# EAGLE schematic Krakatau Board v1.3 (EAGLE 9.6.0)

## Sheet 1 of 7: Microcontroller STM32F413VHT6
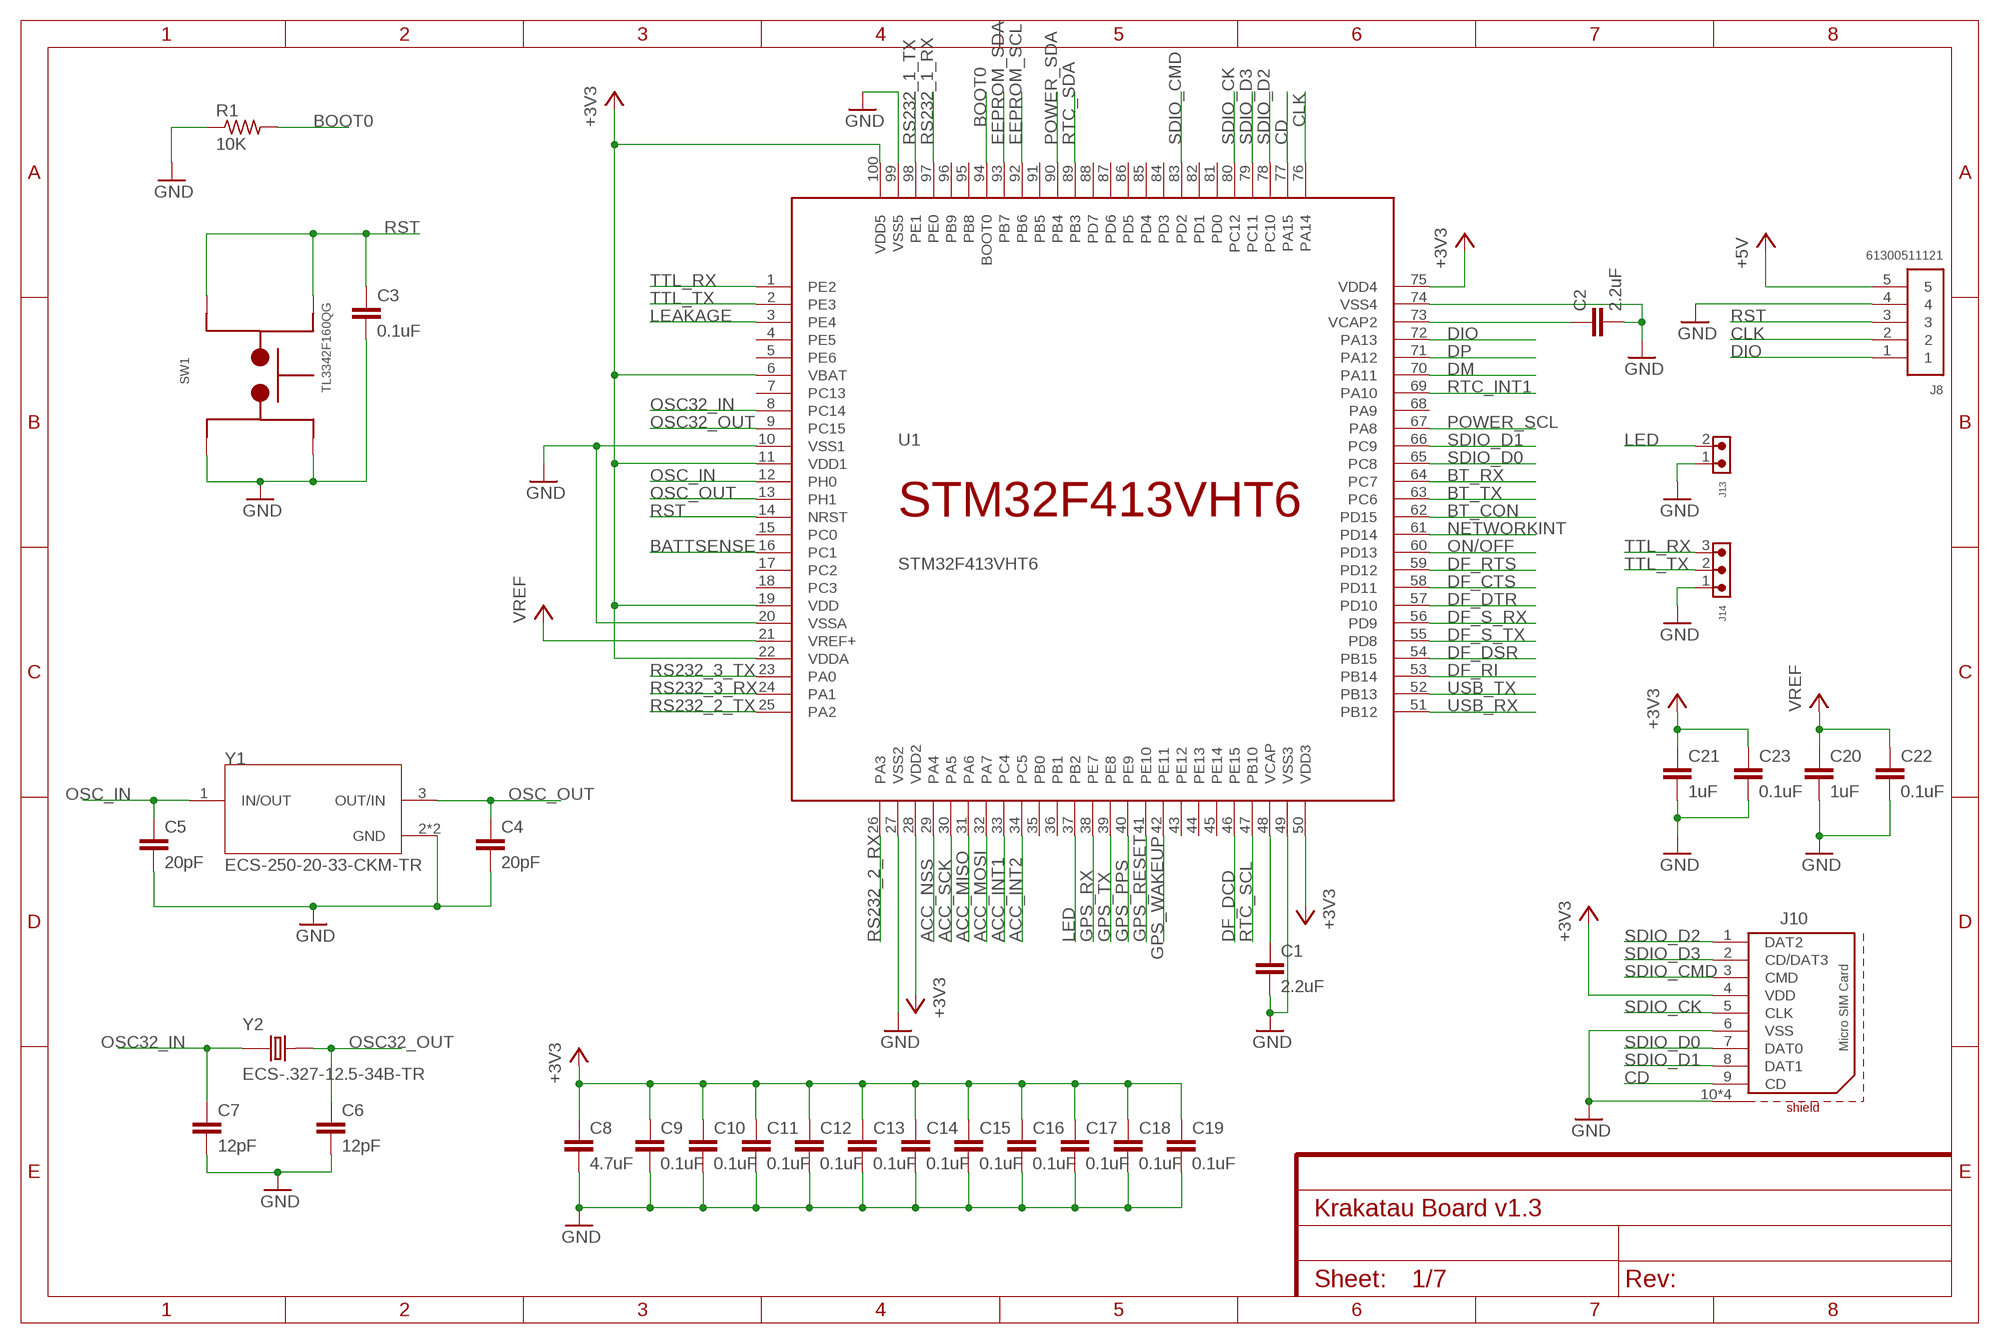
[diagram p0: schematic, sheet 1]

### Parts
C1  2.2uF  C0402-KEMET  [CAPC1005X50N-0402-KEMET]
C2  2.2uF  C0402-KEMET  [CAPC1005X50N-0402-KEMET]
C3  0.1uF  C0402-KEMET  [CAPC1005X50N-0402-KEMET]
C4  20pF  C0402-KEMET  [CAPC1005X50N-0402-KEMET]
C5  20pF  C0402-KEMET  [CAPC1005X50N-0402-KEMET]
C6  12pF  C0402-KEMET  [CAPC1005X50N-0402-KEMET]
C7  12pF  C0402-KEMET  [CAPC1005X50N-0402-KEMET]
C8  4.7uF  C1210-KEMET  [CAPC3225X90N-1210-KEMET]
C9  0.1uF  C0402-KEMET  [CAPC1005X50N-0402-KEMET]
C10  0.1uF  C0402-KEMET  [CAPC1005X50N-0402-KEMET]
C11  0.1uF  C0402-KEMET  [CAPC1005X50N-0402-KEMET]
C12  0.1uF  C0402-KEMET  [CAPC1005X50N-0402-KEMET]
C13  0.1uF  C0402-KEMET  [CAPC1005X50N-0402-KEMET]
C14  0.1uF  C0402-KEMET  [CAPC1005X50N-0402-KEMET]
C15  0.1uF  C0402-KEMET  [CAPC1005X50N-0402-KEMET]
C16  0.1uF  C0402-KEMET  [CAPC1005X50N-0402-KEMET]
C17  0.1uF  C0402-KEMET  [CAPC1005X50N-0402-KEMET]
C18  0.1uF  C0402-KEMET  [CAPC1005X50N-0402-KEMET]
C19  0.1uF  C0402-KEMET  [CAPC1005X50N-0402-KEMET]
C20  1uF  C0603-KEMET  [CAPC1608X80N-0603-KEMET]
C21  1uF  C0603-KEMET  [CAPC1608X80N-0603-KEMET]
C22  0.1uF  C0402-KEMET  [CAPC1005X50N-0402-KEMET]
C23  0.1uF  C0402-KEMET  [CAPC1005X50N-0402-KEMET]
J8  61300511121  [61300511121]
J10  693071020811  [693071020811]
J13  61900211121  [61900211121]
J14  61900311121  [61900311121]
R1  10K  R0402-VISHAYDALE  [RESC1005X35N-0402-VISHAYDALE]
SW1  TL3342F160QG  [SW_TL3342F160QG]
U1  STM32F413VHT6  [QFP50P1590X1590X160-100N]
Y1  ECS-250-20-33-CKM-TR  [XTAL_ECS-250-20-33-CKM-TR]
Y2  ECS-.327-12.5-34B-TR  [XTAL_ECS-.327-12.5-34B-TR]

### Nets
+3V3: C8.1 C9.1 C10.1 C11.1 C12.1 C13.1 C14.1 C15.1 C16.1 C17.1 C18.1 C19.1 C21.1 C23.1 J10.4(VDD) U1.6(VBAT) U1.11(VDD1) U1.19(VDD) U1.22(VDDA) U1.28(VDD2) U1.50(VDD3) U1.75(VDD4) U1.100(VDD5) ; also sheet 2,3,5,6,7
+5V: J8.5 ; also sheet 2,3,4
ACC_INT1: U1.33(PC4) ; also sheet 7
ACC_INT2: U1.34(PC5) ; also sheet 7
ACC_MISO: U1.31(PA6) ; also sheet 7
ACC_MOSI: U1.32(PA7) ; also sheet 7
ACC_NSS: U1.29(PA4) ; also sheet 7
ACC_SCK: U1.30(PA5) ; also sheet 7
BATTSENSE: U1.16(PC1) ; also sheet 3
BOOT0: R1.2 U1.94(BOOT0)
BT_CON: U1.62(PD15) ; also sheet 2
BT_RX: U1.64(PC7) ; also sheet 2
BT_TX: U1.63(PC6) ; also sheet 2
CD: J10.9(CD) U1.77(PA15)
CLK: J8.2 U1.76(PA14)
DF_CTS: U1.58(PD11) ; also sheet 2
DF_DCD: U1.46(PE15) ; also sheet 2
DF_DSR: U1.54(PB15) ; also sheet 2
DF_DTR: U1.57(PD10) ; also sheet 2
DF_RI: U1.53(PB14) ; also sheet 2
DF_RTS: U1.59(PD12) ; also sheet 2
DF_S_RX: U1.56(PD9) ; also sheet 2
DF_S_TX: U1.55(PD8) ; also sheet 2
DIO: J8.1 U1.72(PA13)
DM: U1.70(PA11)
DP: U1.71(PA12)
EEPROM_SCL: U1.92(PB6) ; also sheet 6
EEPROM_SDA: U1.93(PB7) ; also sheet 6
GND: C1.2 C2.2 C3.2 C4.2 C5.2 C6.2 C7.2 C8.2 C9.2 C10.2 C11.2 C12.2 C13.2 C14.2 C15.2 C16.2 C17.2 C18.2 C19.2 C20.2 C21.2 C22.2 C23.2 J8.4 J10.6(VSS) J10.10(SHIELD) J10.11(SHIELD) J10.12(SHIELD) J10.13(SHIELD) J13.1 J14.1 R1.1 SW1.1 SW1.2 U1.10(VSS1) U1.20(VSSA) U1.27(VSS2) U1.49(VSS3) U1.74(VSS4) U1.99(VSS5) Y1.2(GND) Y1.4(GND) ; also sheet 2,3,4,5,6,7
GPS_PPS: U1.40(PE9) ; also sheet 5
GPS_RESET: U1.41(PE10) ; also sheet 5
GPS_RX: U1.38(PE7) ; also sheet 5
GPS_TX: U1.39(PE8) ; also sheet 5
GPS_WAKEUP: U1.42(PE11) ; also sheet 5
LEAKAGE: U1.3(PE4) ; also sheet 7
LED: J13.2 U1.37(PB2)
N$1: C2.1 U1.73(VCAP2)
N$2: C1.1 U1.48(VCAP)
NETWORKINT: U1.61(PD14) ; also sheet 2
ON/OFF: U1.60(PD13) ; also sheet 2
OSC32_IN: C7.1 U1.8(PC14) Y2.1
OSC32_OUT: C6.1 U1.9(PC15) Y2.2
OSC_IN: C5.1 U1.12(PH0) Y1.1(IN/OUT)
OSC_OUT: C4.1 U1.13(PH1) Y1.3(OUT/IN)
POWER_SCL: U1.67(PA8) ; also sheet 7
POWER_SDA: U1.90(PB4) ; also sheet 7
RS232_1_RX: U1.97(PE0) ; also sheet 4
RS232_1_TX: U1.98(PE1) ; also sheet 4
RS232_2_RX: U1.26(PA3) ; also sheet 4
RS232_2_TX: U1.25(PA2) ; also sheet 4
RS232_3_RX: U1.24(PA1) ; also sheet 4
RS232_3_TX: U1.23(PA0) ; also sheet 4
RST: C3.1 J8.3 SW1.3 SW1.4 U1.14(NRST)
RTC_INT1: U1.69(PA10) ; also sheet 6
RTC_SCL: U1.47(PB10) ; also sheet 6
RTC_SDA: U1.89(PB3) ; also sheet 6
SDIO_CK: J10.5(CLK) U1.80(PC12)
SDIO_CMD: J10.3(CMD) U1.83(PD2)
SDIO_D0: J10.7(DAT0) U1.65(PC8)
SDIO_D1: J10.8(DAT1) U1.66(PC9)
SDIO_D2: J10.1(DAT2) U1.78(PC10)
SDIO_D3: J10.2(CD/DAT3) U1.79(PC11)
TTL_RX: J14.3 U1.1(PE2)
TTL_TX: J14.2 U1.2(PE3)
USB_RX: U1.51(PB12) ; also sheet 4
USB_TX: U1.52(PB13) ; also sheet 4
VCC: C20.1 C22.1 U1.21(VREF+) ; supply symbol labelled VREF ; also sheet 3
Unconnected: U1.4(PE5) U1.5(PE6) U1.7(PC13) U1.15(PC0) U1.17(PC2) U1.18(PC3) U1.35(PB0) U1.36(PB1) U1.43(PE12) U1.44(PE13) U1.45(PE14) U1.68(PA9) U1.81(PD0) U1.82(PD1) U1.84(PD3) U1.85(PD4) U1.86(PD5) U1.87(PD6) U1.88(PD7) U1.91(PB5) U1.95(PB8) U1.96(PB9)

## Sheet 2 of 7
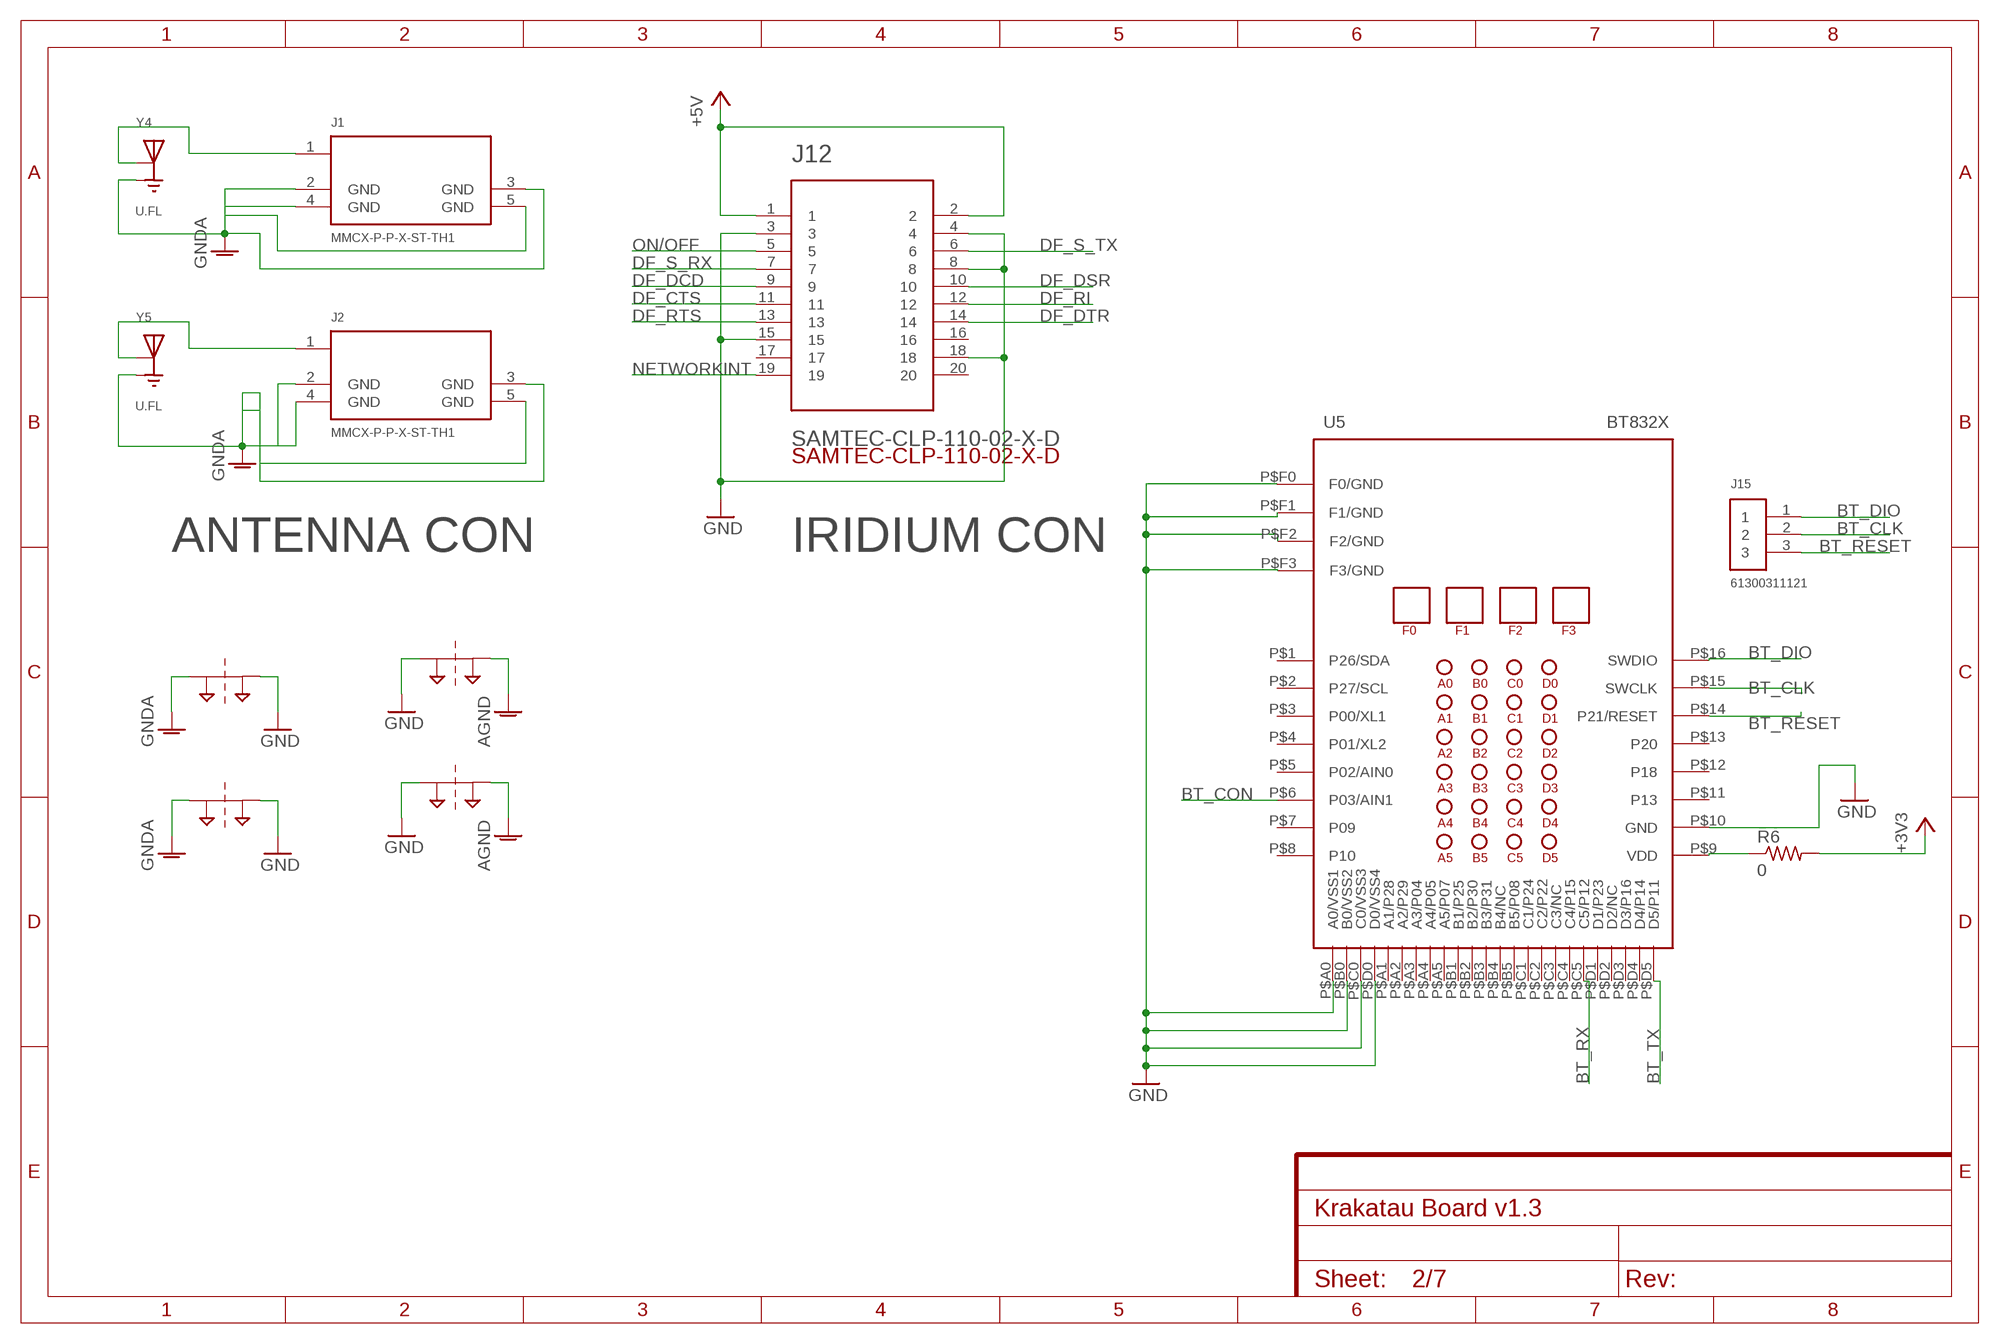
[diagram p1: schematic, sheet 2]

### Parts
J1  MMCX-P-P-X-ST-TH1  [MMCX-P-P-X-ST-TH1]
J2  MMCX-P-P-X-ST-TH1  [MMCX-P-P-X-ST-TH1]
J12  SAMTEC-CLP-110-02-X-D  [SAMTEC-CLP-110-02-X-D]
J15  61300311121  [61300311121]
R6  0  R0402-TE  [RESC1005X30N]
SUPPLY4  2PT_GND_TIE  [2PT_GND_TIE]
SUPPLY5  2PT_GND_TIE  [2PT_GND_TIE]
SUPPLY6  2PT_GND_TIE  [2PT_GND_TIE]
SUPPLY7  2PT_GND_TIE  [2PT_GND_TIE]
U5  BT832X  [BT832X]
Y4  U.FL  [HRS_U.FL-R-SMT-1(10)]
Y5  U.FL  [HRS_U.FL-R-SMT-1(10)]

### Nets
+3V3: R6.2 ; also sheet 1,3,5,6,7
+5V: J12.1 J12.2 ; also sheet 1,3,4
AGND: SUPPLY5.P$2 SUPPLY6.P$2 ; also sheet 5
BT_CLK: J15.2 U5.P$15(SWCLK)
BT_CON: U5.P$6(P03/AIN1) ; also sheet 1
BT_DIO: J15.1 U5.P$16(SWDIO)
BT_RESET: J15.3 U5.P$14(P21/RESET)
BT_RX: U5.P$C5(C5/P12) ; also sheet 1
BT_TX: U5.P$D5(D5/P11) ; also sheet 1
DF_CTS: J12.11 ; also sheet 1
DF_DCD: J12.9 ; also sheet 1
DF_DSR: J12.10 ; also sheet 1
DF_DTR: J12.14 ; also sheet 1
DF_RI: J12.12 ; also sheet 1
DF_RTS: J12.13 ; also sheet 1
DF_S_RX: J12.7 ; also sheet 1
DF_S_TX: J12.6 ; also sheet 1
GND: J12.3 J12.4 J12.8 J12.15 J12.18 SUPPLY4.P$2 SUPPLY5.P$1 SUPPLY6.P$1 SUPPLY7.P$2 U5.P$10(GND) U5.P$A0(A0/VSS1) U5.P$B0(B0/VSS2) U5.P$C0(C0/VSS3) U5.P$D0(D0/VSS4) U5.P$F0(F0/GND) U5.P$F1(F1/GND) U5.P$F2(F2/GND) U5.P$F3(F3/GND) ; also sheet 1,3,4,5,6,7
GNDA: J1.2(GND) J1.3(GND) J1.4(GND) J1.5(GND) J2.2(GND) J2.3(GND) J2.4(GND) J2.5(GND) SUPPLY4.P$1 SUPPLY7.P$1 Y4.1(GND) Y4.3(GND) Y5.1(GND) Y5.3(GND)
N$15: R6.1 U5.P$9(VDD)
N$118: J1.1 Y4.2(SIG)
N$120: J2.1 Y5.2(SIG)
NETWORKINT: J12.19 ; also sheet 1
ON/OFF: J12.5 ; also sheet 1
Unconnected: J12.16 J12.17 J12.20 U5.P$1(P26/SDA) U5.P$2(P27/SCL) U5.P$3(P00/XL1) U5.P$4(P01/XL2) U5.P$5(P02/AIN0) U5.P$7(P09) U5.P$8(P10) U5.P$11(P13) U5.P$12(P18) U5.P$13(P20) U5.P$A1(A1/P28) U5.P$A2(A2/P29) U5.P$A3(A3/P04) U5.P$A4(A4/P05) U5.P$A5(A5/P07) U5.P$B1(B1/P25) U5.P$B2(B2/P30) U5.P$B3(B3/P31) U5.P$B4(B4/NC) U5.P$B5(B5/P08) U5.P$C1(C1/P24) U5.P$C2(C2/P22) U5.P$C3(C3/NC) U5.P$C4(C4/P15) U5.P$D1(D1/P23) U5.P$D2(D2/NC) U5.P$D3(D3/P16) U5.P$D4(D4/P14)

### Notes on the sheet
- ANTENNA CON | IRIDIUM CON

## Sheet 3 of 7
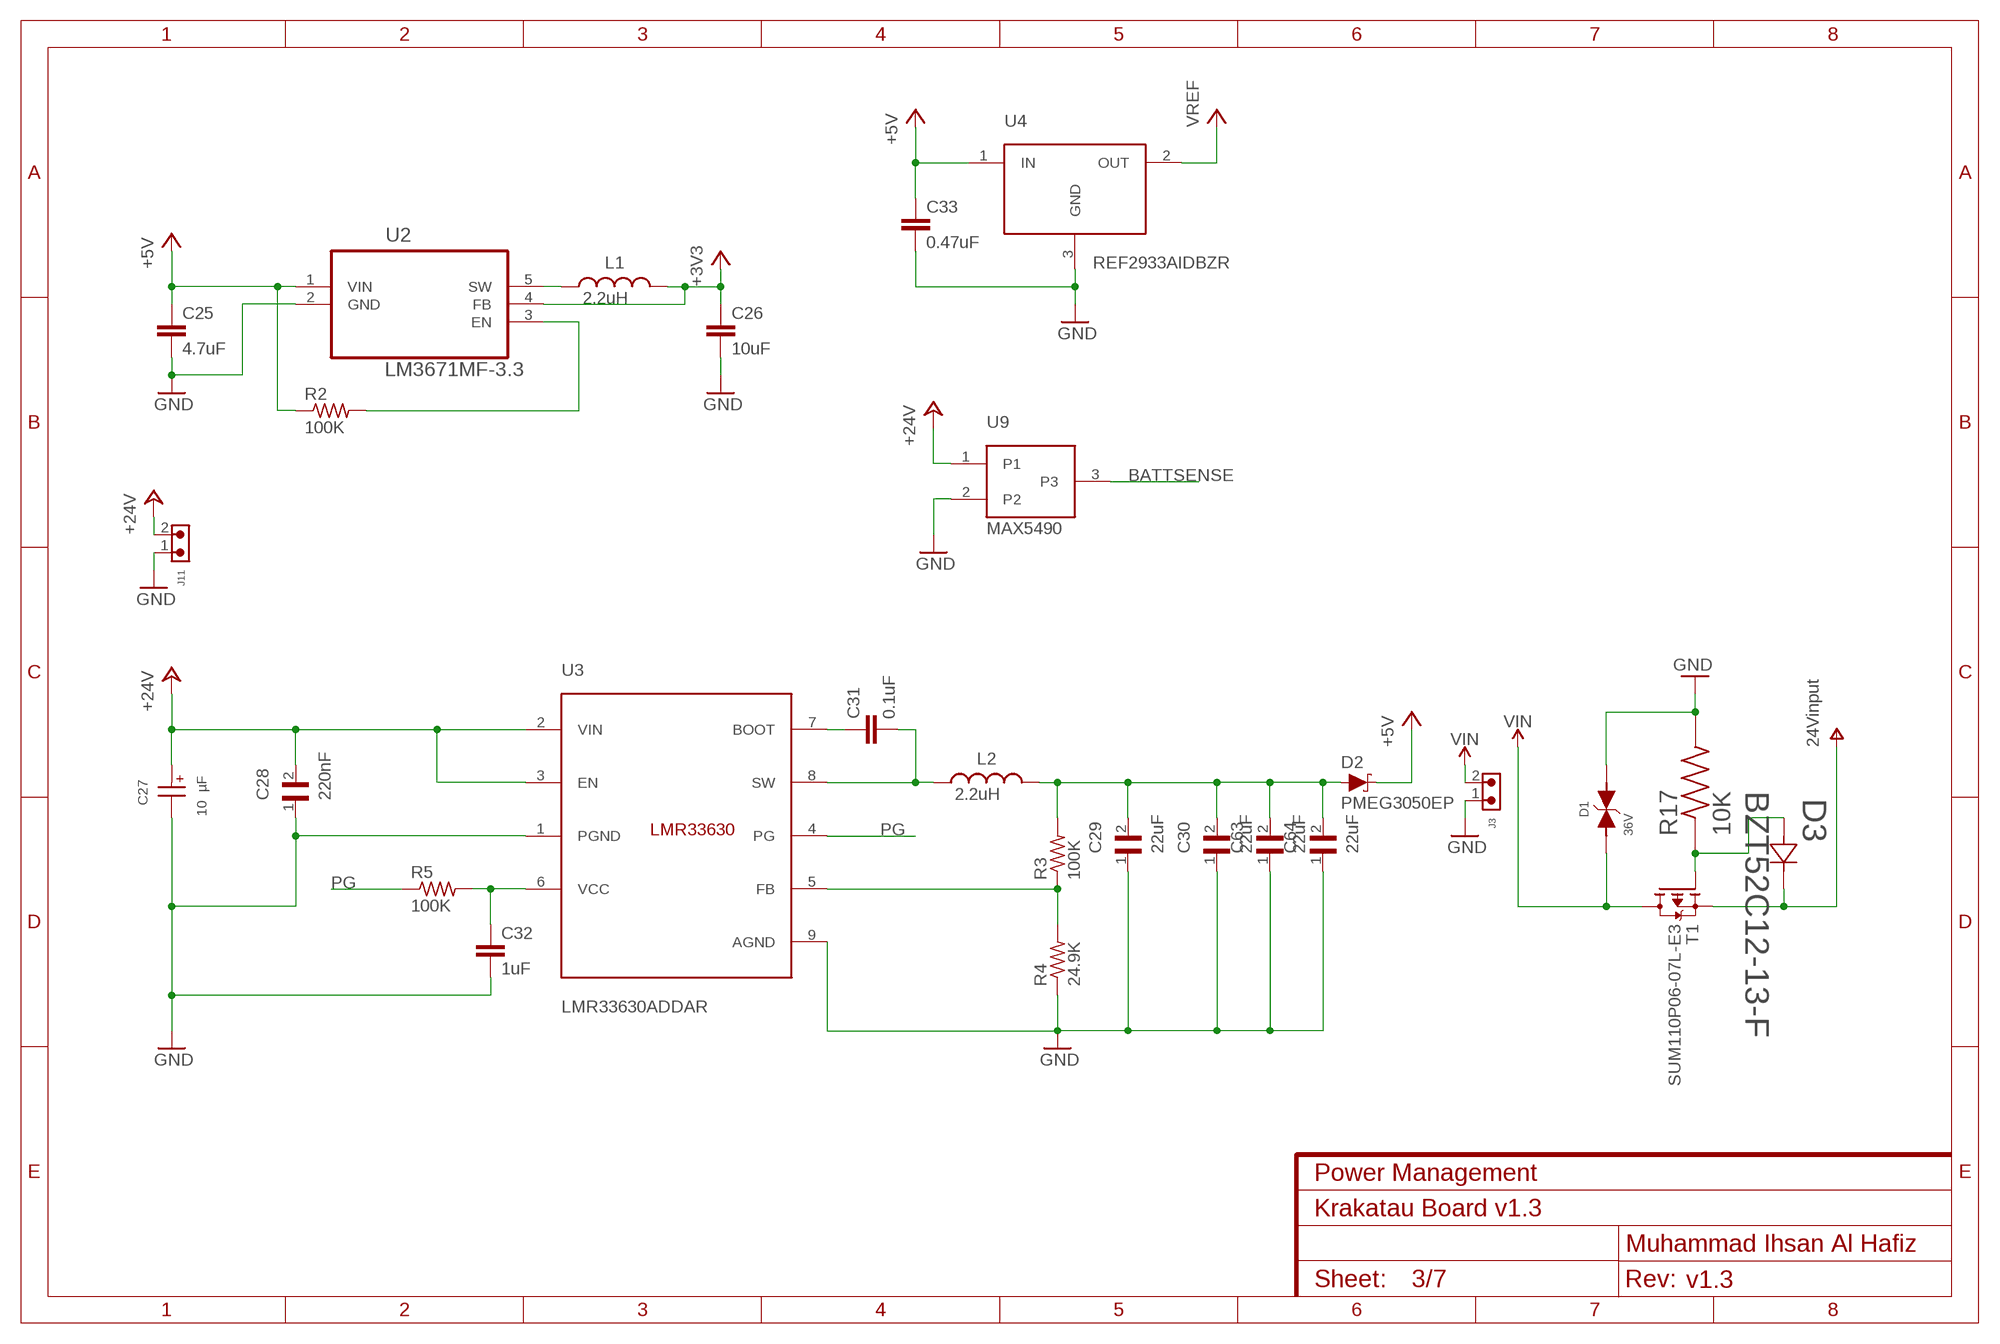
[diagram p2: schematic, sheet 3]
FRAME3 (FRAME-A4L): CNAME: Power Management; CREVISION: v1.3; DESIGNER: Muhammad Ihsan Al Hafiz

### Parts
C25  4.7uF  C0805-KEMET  [CAPC2113X90N-0805-KEMET]
C26  10uF  C0805-KEMET  [CAPC2113X90N-0805-KEMET]
C27  10 µF  WCAP-AS5H_5X5.5_865230542002  [WCAP-AS5H_5X5.5(DXL)]
C28  220nF  C0805C224K5RACAUTO  [CAPC2012X100N]
C29  22uF  LMK212BBJ226MD-T  [CAPC2113X95N]
C30  22uF  LMK212BBJ226MD-T  [CAPC2113X95N]
C31  0.1uF  C0402-KEMET  [CAPC1005X50N-0402-KEMET]
C32  1uF  C0603-KEMET  [CAPC1608X80N-0603-KEMET]
C33  0.47uF  C0402-KEMET  [CAPC1005X50N-0402-KEMET]
C63  22uF  LMK212BBJ226MD-T  [CAPC2113X95N]
C64  22uF  LMK212BBJ226MD-T  [CAPC2113X95N]
D1  36V  WE-TVSP_DO-214AB_3000W_BI_824551361  [WE-TVSP_DO-214AB_BIDIRECTIONAL]
D2  PMEG3050EP  [SODFL4725X110N]
D3  BZT52C12-13-F  [SOD123_DIO]
J3  61900211021  [61900211021]
J11  61900211021  [61900211021]
L1  2.2uH  WE-MAIA_4020_78438356022  [WE-MAIA_4020]
L2  2.2uH  WE-MAIA_4020_78438356022  [WE-MAIA_4020]
R2  100K  R0402-VISHAYDALE  [RESC1005X35N-0402-VISHAYDALE]
R3  100K  R0402-VISHAYDALE  [RESC1005X35N-0402-VISHAYDALE]
R4  24.9K  R0402-TE  [RESC1005X30N]
R5  100K  R0402-VISHAYDALE  [RESC1005X35N-0402-VISHAYDALE]
R17  10K  TNPW0603100KBETA  [RESC1608X55N]
T1  SUM110P06-07L-E3  [TO-263AB_SUM]
U2  LM3671MF-3.3  [SOT95P284X122-5N]
U3  LMR33630ADDAR  [SOIC127P600X170-9T260X310N]
U4  REF2933AIDBZR  [SOT95P237X112-3N]
U9  MAX5490  [SOT95P237X110-3]

### Nets
+3V3: C26.1 L1.2 U2.4(FB) ; also sheet 1,2,5,6,7
+5V: C25.1 C33.1 D2.C R2.1 U2.1(VIN) U4.1(IN) ; also sheet 1,2,4
+24V: C27.1(+) C28.2 J11.2 U3.2(VIN) U3.3(EN) U9.1 ; also sheet 7
BATTSENSE: U9.3 ; also sheet 1
GND: C25.2 C26.2 C27.2(-) C28.1 C29.1 C30.1 C32.2 C33.2 C63.1 C64.1 D1.2 J3.1 J11.1 R4.1 R17.2 U2.2(GND) U3.1(PGND) U3.9(AGND) U4.3(GND) U9.2 ; also sheet 1,2,4,5,6,7
N$7: L1.1 U2.5(SW)
N$11: C31.1 U3.7(BOOT)
N$12: C29.2 C30.2 C63.2 C64.2 D2.A L2.2 R3.2
N$14: C32.1 R5.2 U3.6(VCC)
N$23: C31.2 L2.1 U3.8(SW)
N$41: R3.1 R4.2 U3.5(FB)
N$115: D3.2 R17.1 T1.1(G)
N$123: R2.2 U2.3(EN)
PG: R5.1 U3.4(PG)
V+: D3.1 T1.3(S) ; supply symbol labelled 24Vinput ; also sheet 7
VCC: U4.2(OUT) ; supply symbol labelled VREF ; also sheet 1
VIN: D1.1 J3.2 T1.2(D)

## Sheet 4 of 7
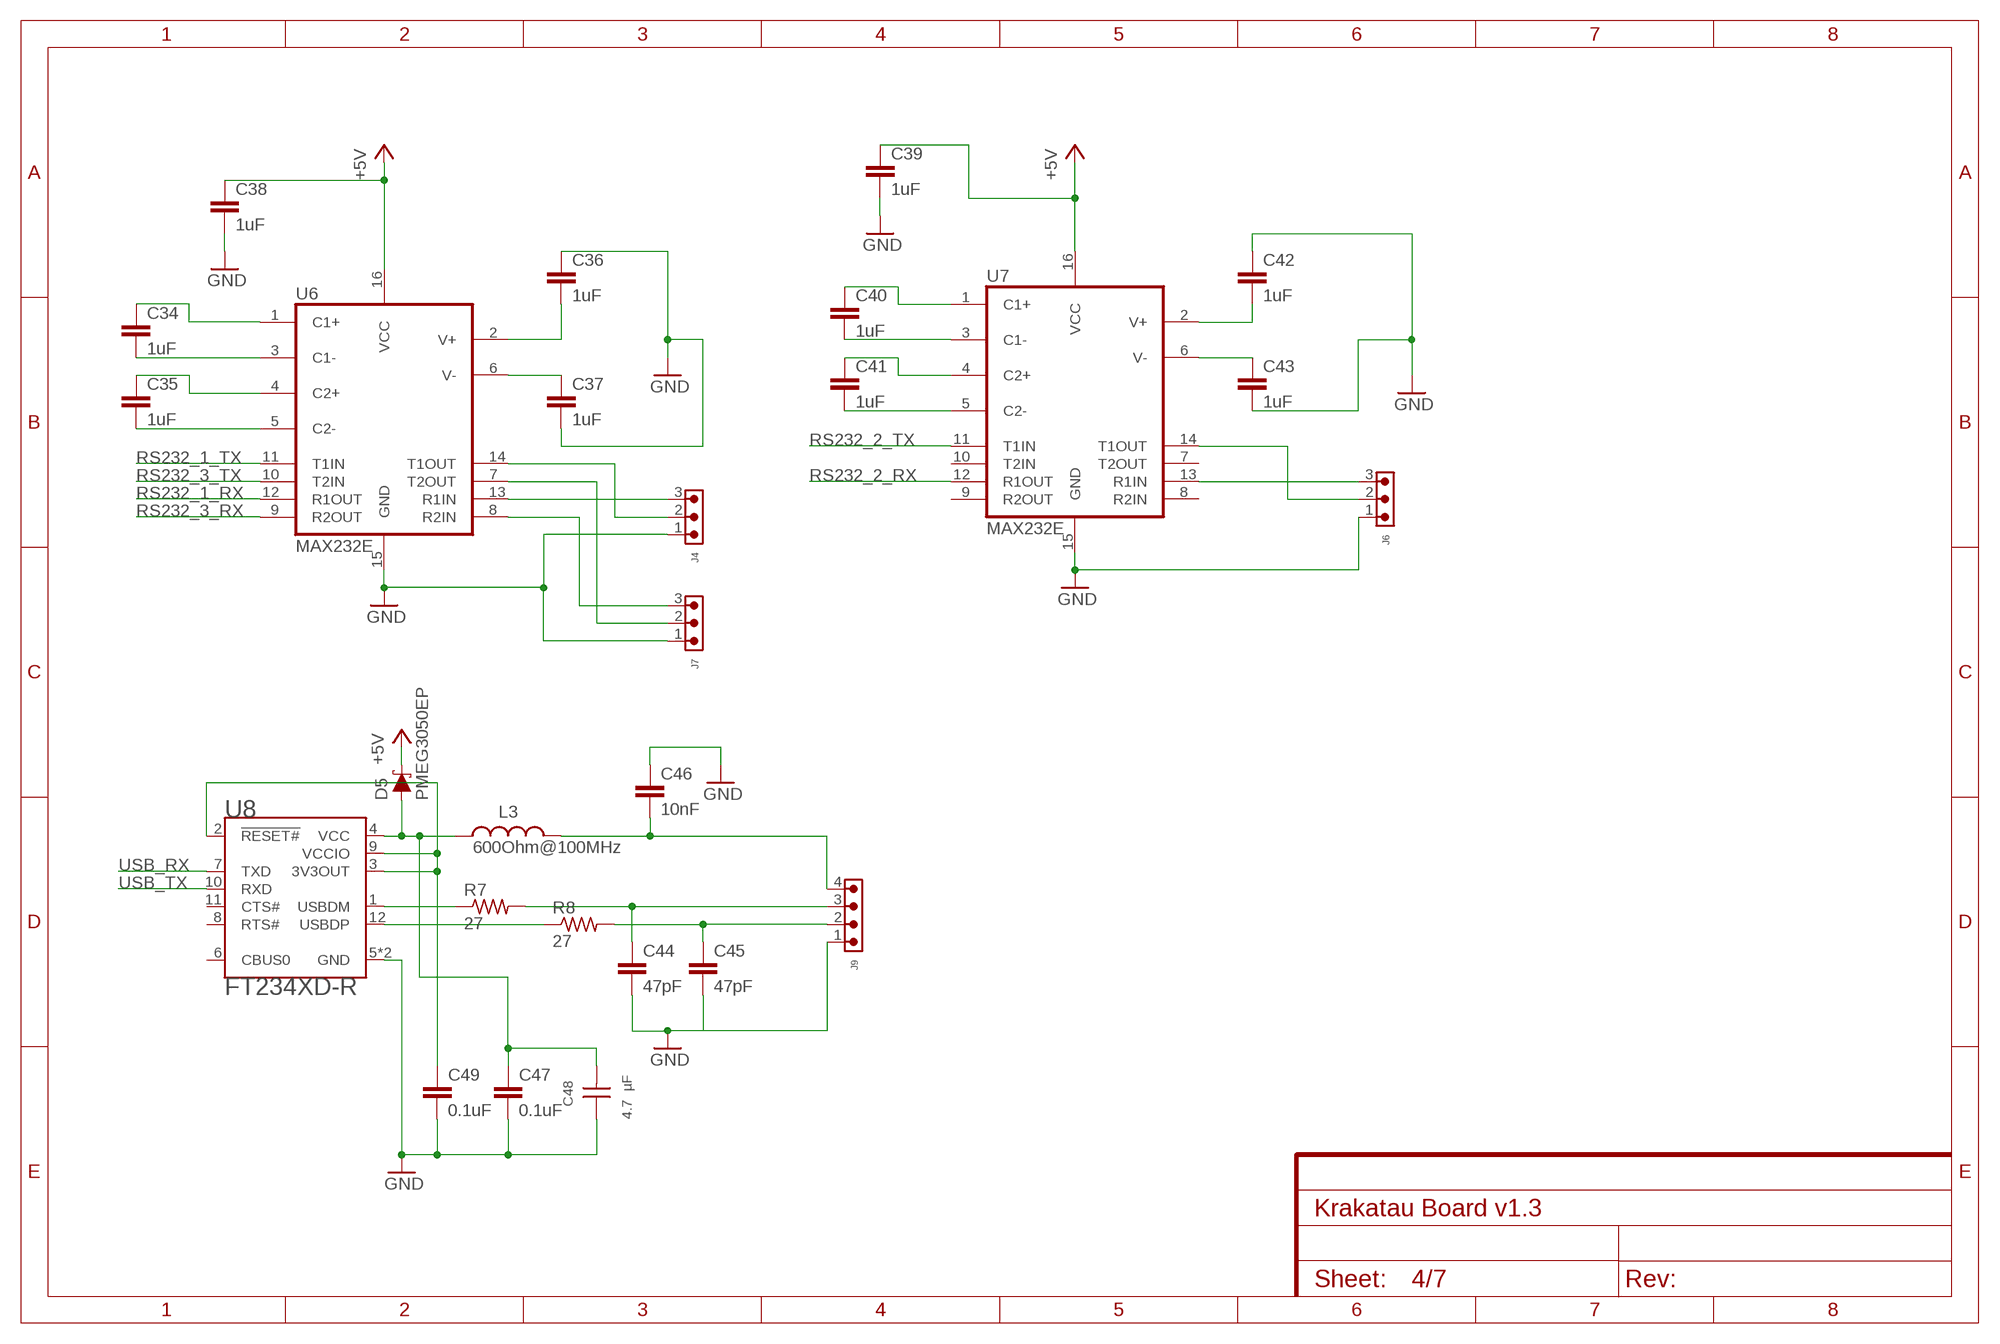
[diagram p3: schematic, sheet 4]

### Parts
C34  1uF  C0603-KEMET  [CAPC1608X80N-0603-KEMET]
C35  1uF  C0603-KEMET  [CAPC1608X80N-0603-KEMET]
C36  1uF  C0603-KEMET  [CAPC1608X80N-0603-KEMET]
C37  1uF  C0603-KEMET  [CAPC1608X80N-0603-KEMET]
C38  1uF  C0603-KEMET  [CAPC1608X80N-0603-KEMET]
C39  1uF  C0603-KEMET  [CAPC1608X80N-0603-KEMET]
C40  1uF  C0603-KEMET  [CAPC1608X80N-0603-KEMET]
C41  1uF  C0603-KEMET  [CAPC1608X80N-0603-KEMET]
C42  1uF  C0603-KEMET  [CAPC1608X80N-0603-KEMET]
C43  1uF  C0603-KEMET  [CAPC1608X80N-0603-KEMET]
C44  47pF  C0402-KEMET  [CAPC1005X50N-0402-KEMET]
C45  47pF  C0402-KEMET  [CAPC1005X50N-0402-KEMET]
C46  10nF  C0402-KEMET  [CAPC1005X50N-0402-KEMET]
C47  0.1uF  C0402-KEMET  [CAPC1005X50N-0402-KEMET]
C48  4.7 µF  WCAP-CSGP_0402_885012105008_6.3V(DC)  [WCAP-CSGP_0402]
C49  0.1uF  C0402-KEMET  [CAPC1005X50N-0402-KEMET]
D5  PMEG3050EP  [SODFL4725X110N]
J4  61900311021  [61900311021]
J6  61900311021  [61900311021]
J7  61900311021  [61900311021]
J9  61900411121  [61900411121]
L3  600Ohm@100MHz  WE-CBF_0603_742792651_HC  [WE-CBF_0603(W=2.6)]
R7  27  R0402-TE  [RESC1005X30N]
R8  27  R0402-TE  [RESC1005X30N]
U6  MAX232E  [SOIC127P1030X265-16N]
U7  MAX232E  [SOIC127P1030X265-16N]
U8  FT234XD-R  [SON45P300X300X75-13N]

### Nets
+5V: C38.1 C39.1 D5.C U6.16(VCC) U7.16(VCC) ; also sheet 1,2,3
GND: C36.1 C37.2 C38.2 C39.2 C42.1 C43.2 C44.2 C45.2 C46.1 C47.2 C48.1 C49.2 J4.1 J6.1 J7.1 J9.1 U6.15(GND) U7.15(GND) U8.5(GND) U8.13(GND) ; also sheet 1,2,3,5,6,7
N$6: J6.2 U7.14(T1OUT)
N$10: J6.3 U7.13(R1IN)
N$16: C34.1 U6.1(C1+)
N$17: C34.2 U6.3(C1-)
N$18: C35.1 U6.4(C2+)
N$19: J4.2 U6.14(T1OUT)
N$21: J4.3 U6.13(R1IN)
N$22: J7.2 U6.7(T2OUT)
N$24: J7.3 U6.8(R2IN)
N$42: C35.2 U6.5(C2-)
N$62: C36.2 U6.2(V+)
N$63: C37.1 U6.6(V-)
N$65: C40.2 U7.3(C1-)
N$66: C40.1 U7.1(C1+)
N$67: C41.1 U7.4(C2+)
N$68: C41.2 U7.5(C2-)
N$69: C43.1 U7.6(V-)
N$70: C42.2 U7.2(V+)
N$71: R7.1 U8.1(USBDM)
N$72: R8.1 U8.12(USBDP)
N$73: C44.1 J9.3 R7.2
N$90: C45.1 J9.2 R8.2
N$91: C46.2 J9.4 L3.2
N$94: C49.1 U8.2(!RESET#) U8.3(3V3OUT) U8.9(VCCIO)
N$125: C47.1 C48.2 D5.A L3.1 U8.4(VCC)
RS232_1_RX: U6.12(R1OUT) ; also sheet 1
RS232_1_TX: U6.11(T1IN) ; also sheet 1
RS232_2_RX: U7.12(R1OUT) ; also sheet 1
RS232_2_TX: U7.11(T1IN) ; also sheet 1
RS232_3_RX: U6.9(R2OUT) ; also sheet 1
RS232_3_TX: U6.10(T2IN) ; also sheet 1
USB_RX: U8.7(TXD) ; also sheet 1
USB_TX: U8.10(RXD) ; also sheet 1
Unconnected: U7.7(T2OUT) U7.8(R2IN) U7.9(R2OUT) U7.10(T2IN) U8.6(CBUS0) U8.8(RTS#) U8.11(CTS#)

## Sheet 5 of 7
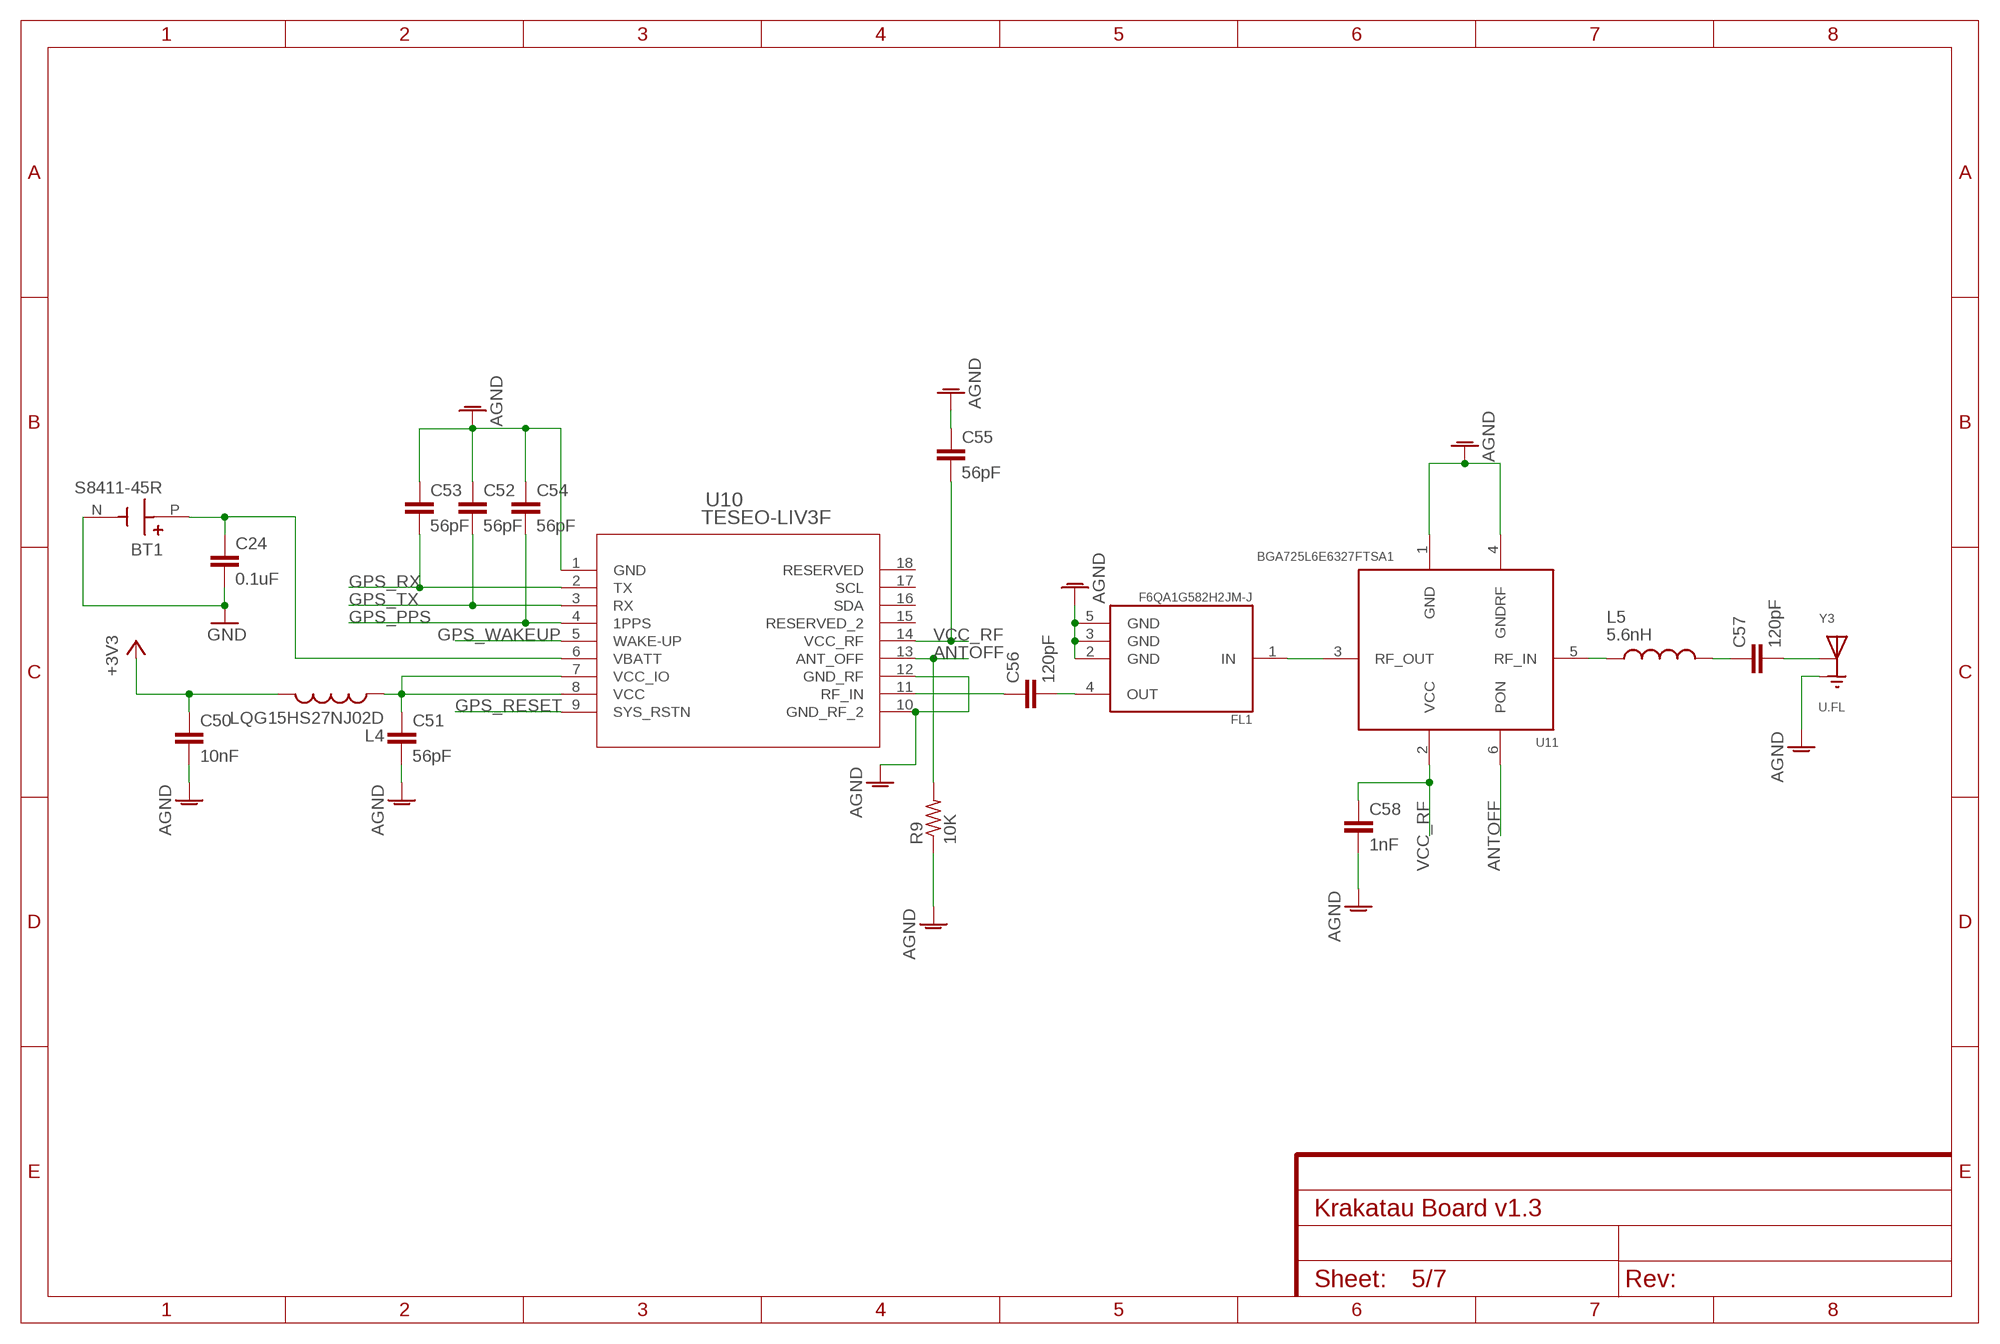
[diagram p4: schematic, sheet 5]

### Parts
BT1  S8411-45R  [BAT_S8411-45R]
C24  0.1uF  C0402-KEMET  [CAPC1005X50N-0402-KEMET]
C50  10nF  C0402-KEMET  [CAPC1005X50N-0402-KEMET]
C51  56pF  C0402-KEMET  [CAPC1005X50N-0402-KEMET]
C52  56pF  C0402-KEMET  [CAPC1005X50N-0402-KEMET]
C53  56pF  C0402-KEMET  [CAPC1005X50N-0402-KEMET]
C54  56pF  C0402-KEMET  [CAPC1005X50N-0402-KEMET]
C55  56pF  C0402-KEMET  [CAPC1005X50N-0402-KEMET]
C56  120pF  C0402-KEMET  [CAPC1005X50N-0402-KEMET]
C57  120pF  C0402-KEMET  [CAPC1005X50N-0402-KEMET]
C58  1nF  C0402-KEMET  [CAPC1005X50N-0402-KEMET]
FL1  F6QA1G582H2JM-J  [FIL_F6QA1G582H2JM-J]
L4  LQG15HS27NJ02D  [INDC1005X55N]
L5  5.6nH  LQW15AN5N6C10D  [INDC1006X60N]
R9  10K  R0402-VISHAYDALE  [RESC1005X35N-0402-VISHAYDALE]
U10  TESEO-LIV3F  [LCC18_9P7X10P1]
U11  BGA725L6E6327FTSA1  [INF-TSLP-6-2_V_1PRIMARY]
Y3  U.FL  [HRS_U.FL-R-SMT-1(10)]

### Nets
+3V3: C50.1 L4.2 ; also sheet 1,2,3,6,7
AGND: C50.2 C51.2 C52.1 C53.1 C54.1 C55.1 C58.2 FL1.2(GND) FL1.3(GND) FL1.5(GND) R9.1 U10.1(GND) U10.10(GND_RF_2) U10.12(GND_RF) U11.1(GND) U11.4(GNDRF) Y3.1(GND) Y3.3(GND) ; also sheet 2
ANTOFF: R9.2 U10.13(ANT_OFF) U11.6(PON)
GND: BT1.N(-) C24.2 ; also sheet 1,2,3,4,6,7
GPS_PPS: C54.2 U10.4(1PPS) ; also sheet 1
GPS_RESET: U10.9(SYS_RSTN) ; also sheet 1
GPS_RX: C53.2 U10.2(TX) ; also sheet 1
GPS_TX: C52.2 U10.3(RX) ; also sheet 1
GPS_WAKEUP: U10.5(WAKE-UP) ; also sheet 1
N$92: C51.1 L4.1 U10.7(VCC_IO) U10.8(VCC)
N$100: C56.2 FL1.4(OUT)
N$101: C56.1 U10.11(RF_IN)
N$102: FL1.1(IN) U11.3(RF_OUT)
N$103: L5.1 U11.5(RF_IN)
N$104: C57.1 L5.2
N$107: C57.2 Y3.2(SIG)
VBAT: BT1.P(+) C24.1 U10.6(VBATT)
VCC_RF: C55.2 C58.1 U10.14(VCC_RF) U11.2(VCC)
Unconnected: U10.15(RESERVED_2) U10.16(SDA) U10.17(SCL) U10.18(RESERVED)

## Sheet 6 of 7
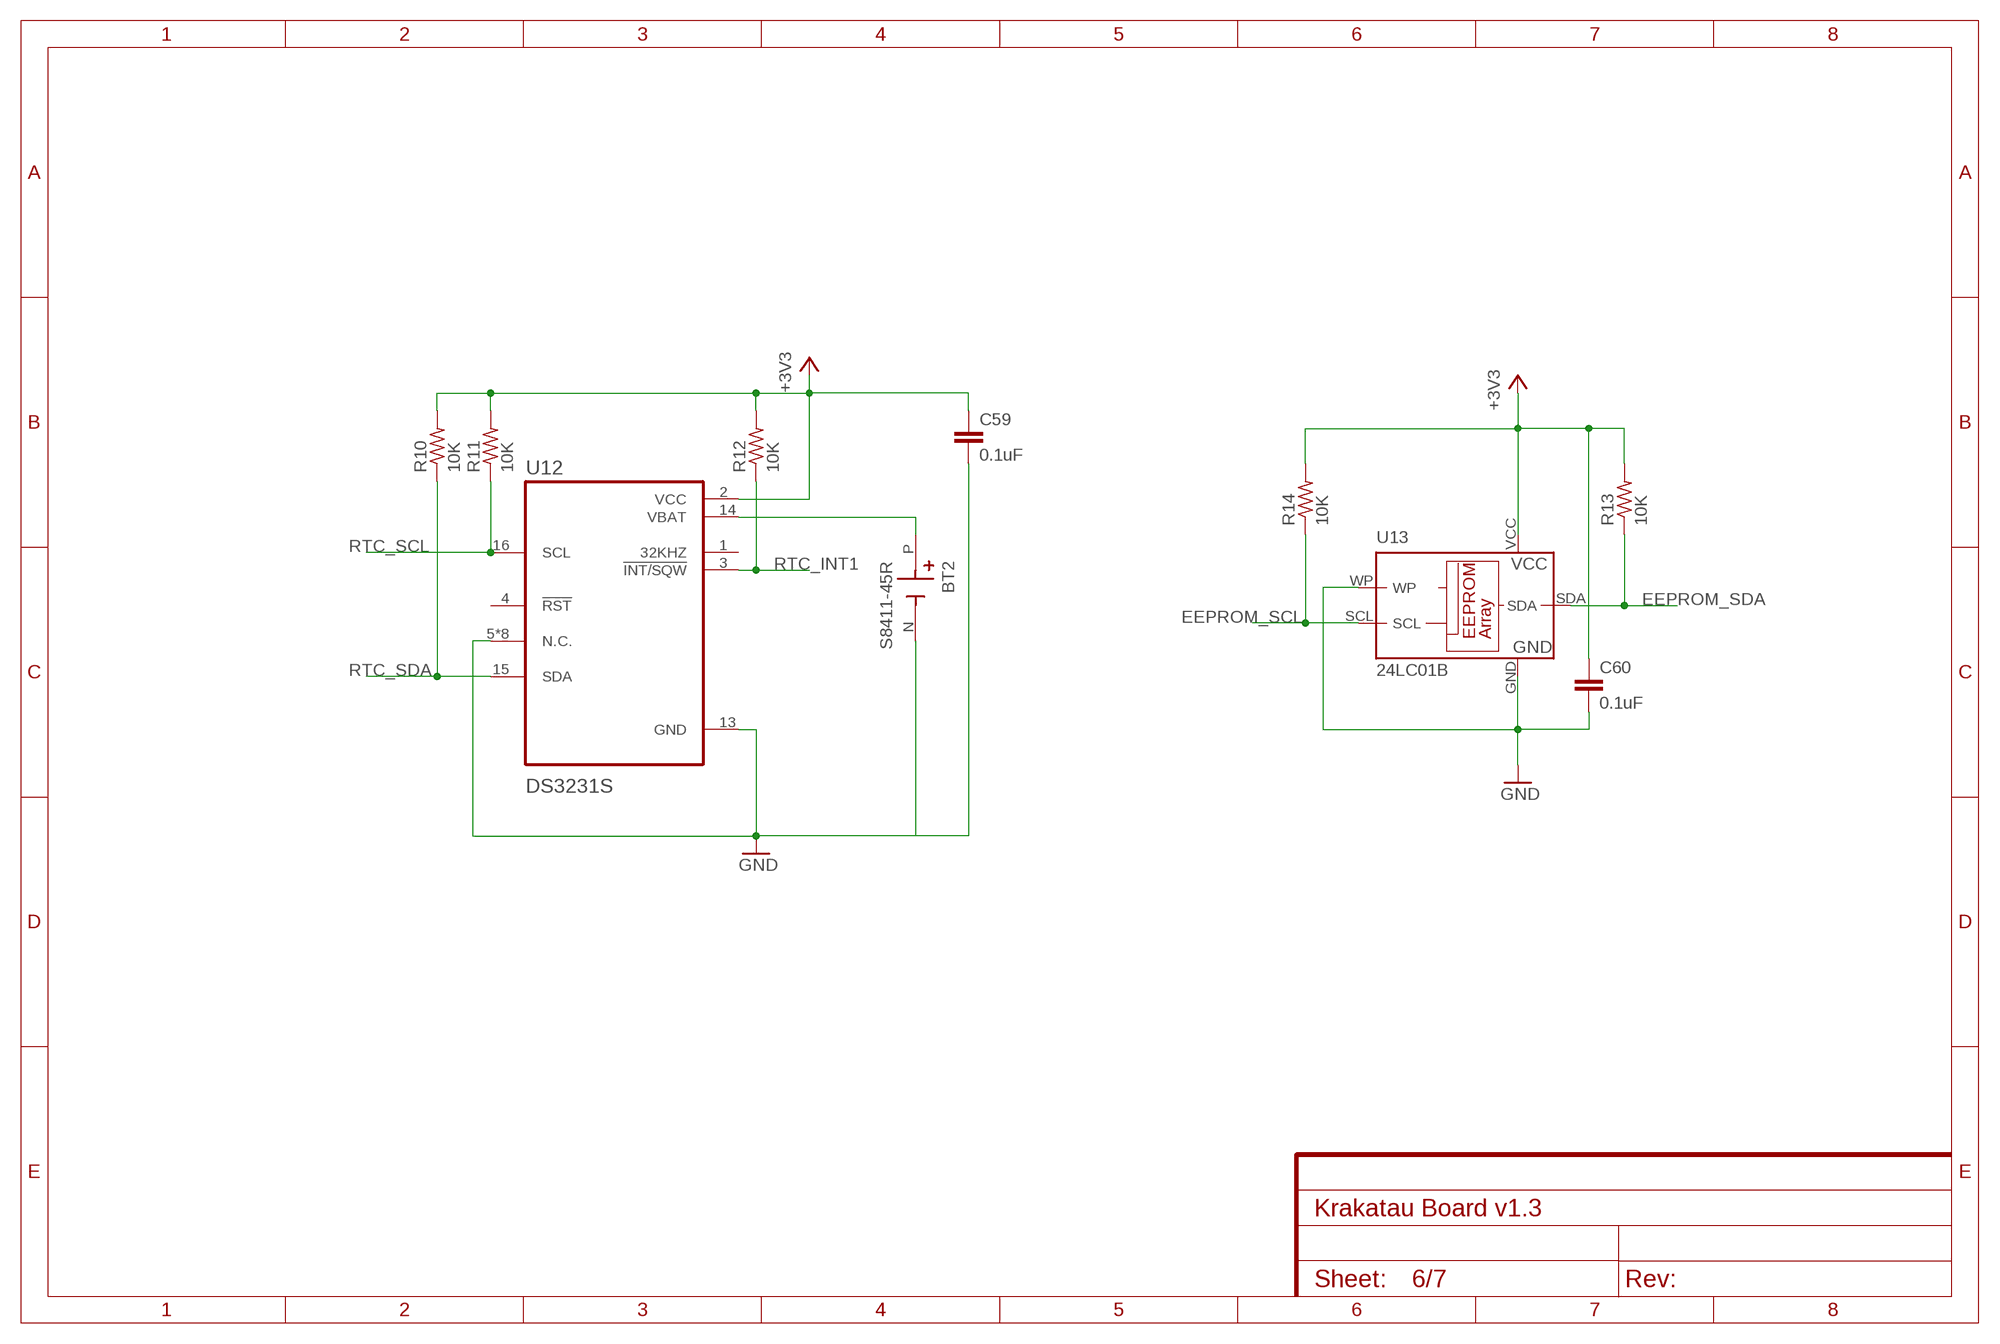
[diagram p5: schematic, sheet 6]

### Parts
BT2  S8411-45R  [BAT_S8411-45R]
C59  0.1uF  C0402-KEMET  [CAPC1005X50N-0402-KEMET]
C60  0.1uF  C0402-KEMET  [CAPC1005X50N-0402-KEMET]
R10  10K  R0402-VISHAYDALE  [RESC1005X35N-0402-VISHAYDALE]
R11  10K  R0402-VISHAYDALE  [RESC1005X35N-0402-VISHAYDALE]
R12  10K  R0402-VISHAYDALE  [RESC1005X35N-0402-VISHAYDALE]
R13  10K  R0402-VISHAYDALE  [RESC1005X35N-0402-VISHAYDALE]
R14  10K  R0402-VISHAYDALE  [RESC1005X35N-0402-VISHAYDALE]
U12  DS3231S  [SOIC127P1032X265-16N]
U13  24LC01B  [SOT23-5L]

### Nets
+3V3: C59.1 C60.1 R10.2 R11.2 R12.2 R13.2 R14.2 U12.2(VCC) U13.VCC ; also sheet 1,2,3,5,7
EEPROM_SCL: R14.1 U13.SCL ; also sheet 1
EEPROM_SDA: R13.1 U13.SDA ; also sheet 1
GND: BT2.N(-) C59.2 C60.2 U12.5(N.C.) U12.6(N.C.) U12.7(N.C.) U12.8(N.C.) U12.9(N.C.) U12.10(N.C.) U12.11(N.C.) U12.12(N.C.) U12.13(GND) U13.GND U13.WP ; also sheet 1,2,3,4,5,7
N$108: BT2.P(+) U12.14(VBAT)
RTC_INT1: R12.1 U12.3(!INT/SQW) ; also sheet 1
RTC_SCL: R11.1 U12.16(SCL) ; also sheet 1
RTC_SDA: R10.1 U12.15(SDA) ; also sheet 1
Unconnected: U12.1(32KHZ) U12.4(!RST)

## Sheet 7 of 7
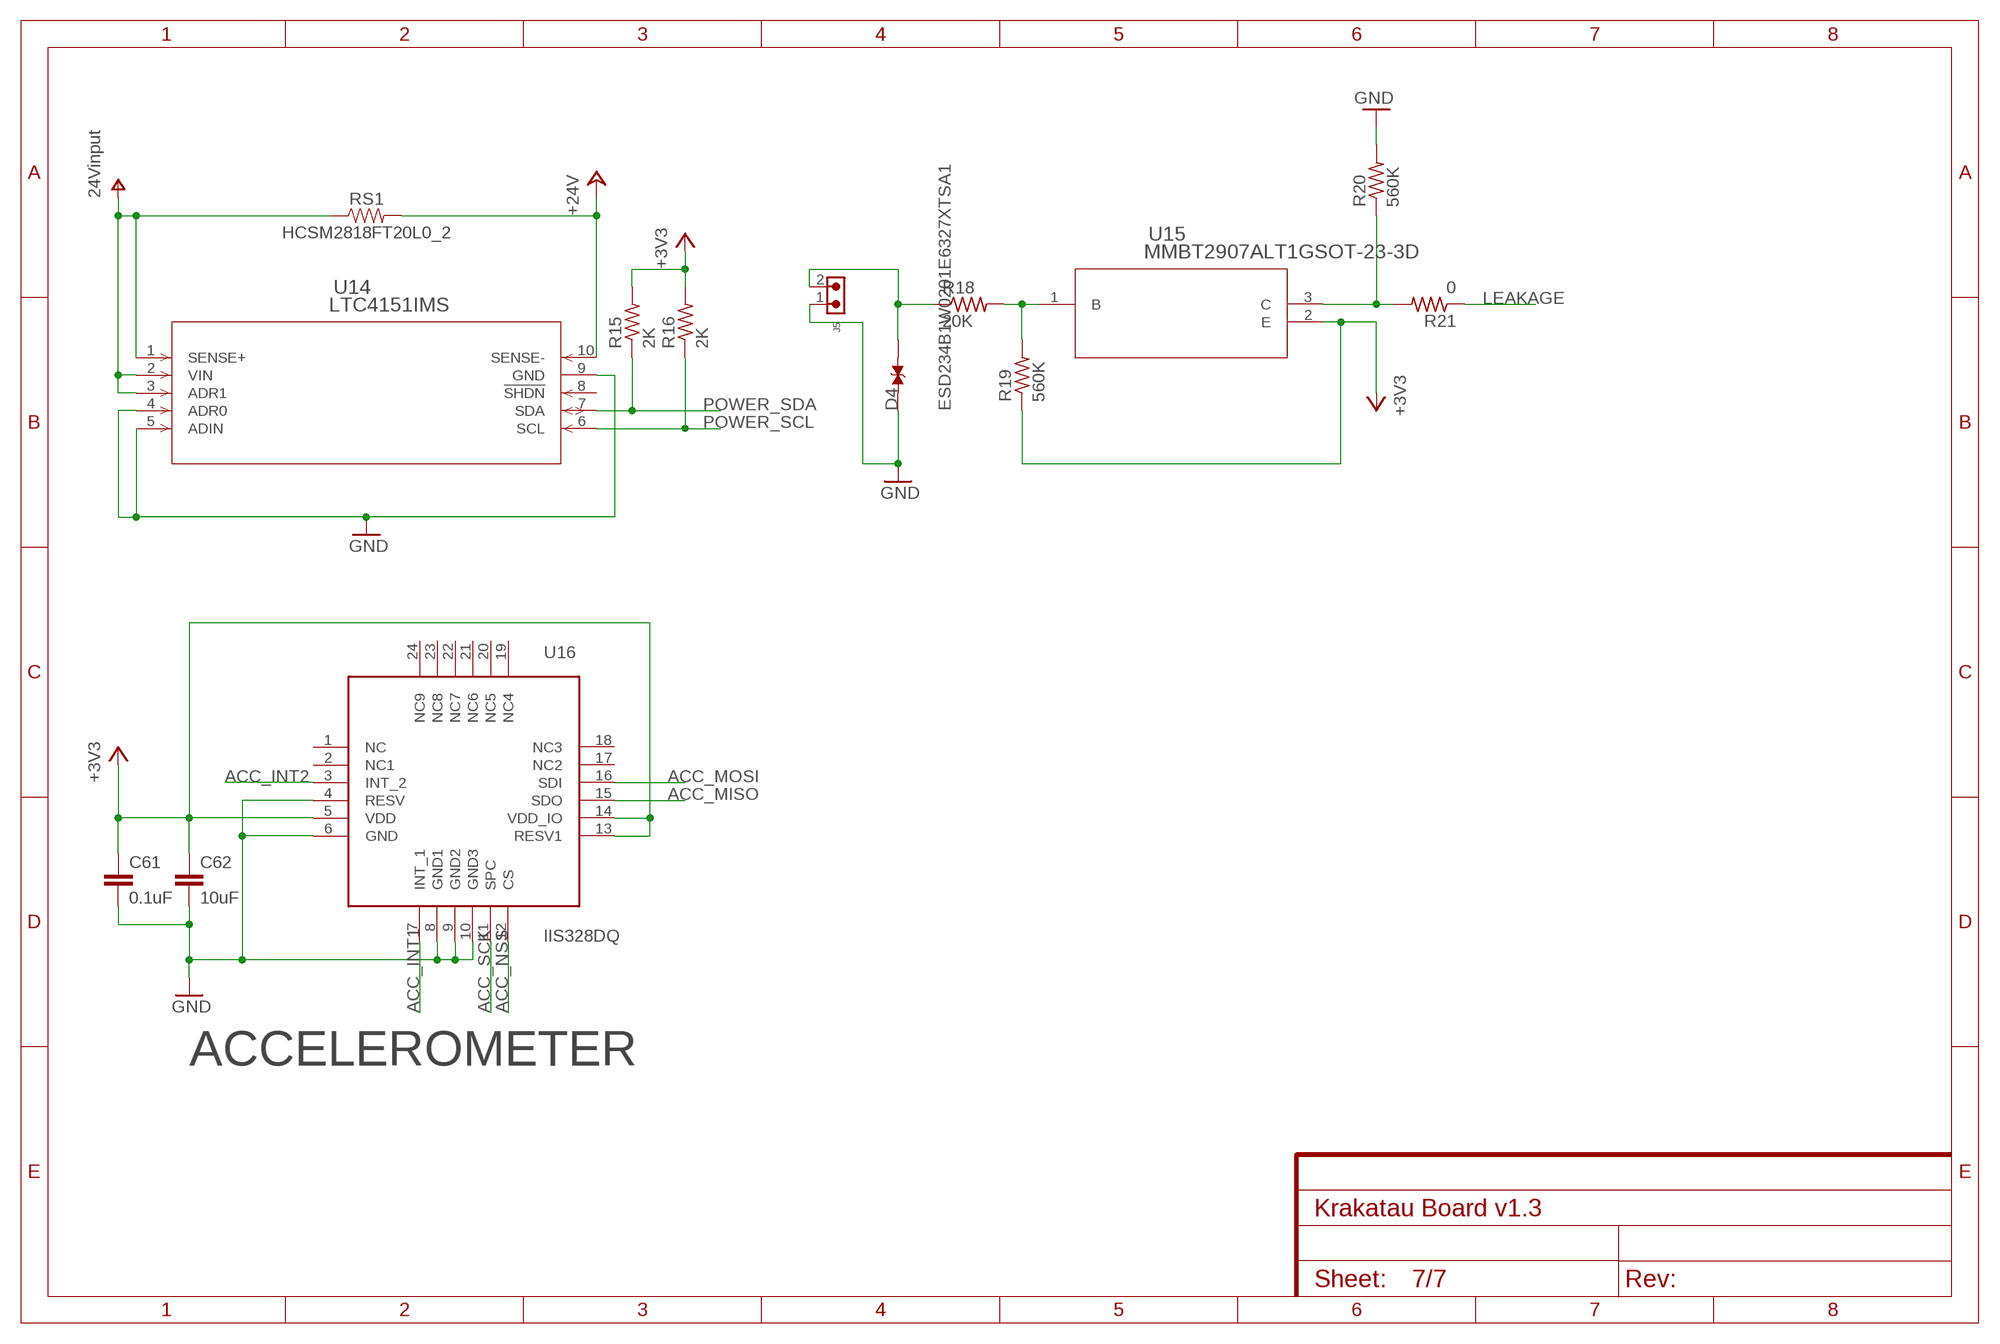
[diagram p6: schematic, sheet 7]

### Parts
C61  0.1uF  C0402-KEMET  [CAPC1005X50N-0402-KEMET]
C62  10uF  C0402-KEMET  [CAPC1005X50N-0402-KEMET]
D4  ESD234B1W0201E6327XTSA1  [DIODFN58X28X16-2N]
J5  61900211021  [61900211021]
R15  2K  R0402-VISHAYDALE  [RESC1005X35N-0402-VISHAYDALE]
R16  2K  R0402-VISHAYDALE  [RESC1005X35N-0402-VISHAYDALE]
R18  20K  R0402-VISHAYDALE  [RESC1005X35N-0402-VISHAYDALE]
R19  560K  R0402-VISHAYDALE  [RESC1005X35N-0402-VISHAYDALE]
R20  560K  R0402-VISHAYDALE  [RESC1005X35N-0402-VISHAYDALE]
R21  0  R0402-VISHAYDALE  [RESC1005X35N-0402-VISHAYDALE]
RS1  HCSM2818FT20L0_2  [RESM7149X165NR]
U14  LTC4151IMS  [SOP50P490X110-10N]
U15  MMBT2907ALT1GSOT-23-3D  [SOT95P237X110-3]
U16  IIS328DQ  [QFN50P400X400X100-24]

### Nets
+3V3: C61.1 C62.1 R15.2 R16.2 R19.1 U15.2(E) U16.5(VDD) U16.13(RESV1) U16.14(VDD_IO) ; also sheet 1,2,3,5,6
+24V: RS1.2 U14.10(SENSE-) ; also sheet 3
ACC_INT1: U16.7(INT_1) ; also sheet 1
ACC_INT2: U16.3(INT_2) ; also sheet 1
ACC_MISO: U16.15(SDO) ; also sheet 1
ACC_MOSI: U16.16(SDI) ; also sheet 1
ACC_NSS: U16.12(CS) ; also sheet 1
ACC_SCK: U16.11(SPC) ; also sheet 1
GND: C61.2 C62.2 D4.1 J5.1 R20.2 U14.4(ADR0) U14.5(ADIN) U14.9(GND) U16.4(RESV) U16.6(GND) U16.8(GND1) U16.9(GND2) U16.10(GND3) ; also sheet 1,2,3,4,5,6
LEAKAGE: R21.1 ; also sheet 1
N$13: D4.2 J5.2 R18.1
N$119: R18.2 R19.2 U15.1(B)
N$121: R20.1 R21.2 U15.3(C)
POWER_SCL: R16.1 U14.6(SCL) ; also sheet 1
POWER_SDA: R15.1 U14.7(SDA) ; also sheet 1
V+: RS1.1 U14.1(SENSE+) U14.2(VIN) U14.3(ADR1) ; supply symbol labelled 24Vinput ; also sheet 3
Unconnected: U14.8(!SHDN) U16.1(NC) U16.2(NC1) U16.17(NC2) U16.18(NC3) U16.19(NC4) U16.20(NC5) U16.21(NC6) U16.22(NC7) U16.23(NC8) U16.24(NC9)

### Notes on the sheet
- ACCELEROMETER

## Library data of the parts
BT1 BT2 = S8411-45R:S8411-45R: Coin Cell Smt Horizontal Insul; DESCRIPTION: Battery Holder _Open_ Coin, 12.0mm 1 Cell SMD _SMT_ Tab; DIGI-KEY_PART_NUMBER: 952-1745-1-ND; DIGI-KEY_PURCHASE_URL: https://www.digikey.co.id/product-detail/en/harwin-inc/S8411-45R/952-1745-1-ND/3131073?utm_source=snapeda&utm_medium=aggregator&utm_campaign=symbol; MF: Harwin Inc.; MP: S8411-45R; PACKAGE: None
C1-C7 C9-C19 C22-C24 C31 C33 C44-C47 C49-C62 = Resistor Capacitor Standard Eagle 3D:C0402-KEMET
C8 = Resistor Capacitor Standard Eagle 3D:C1210-KEMET
C20 C21 C32 C34-C43 = Resistor Capacitor Standard Eagle 3D:C0603-KEMET
C25 C26 = Resistor Capacitor Standard Eagle 3D:C0805-KEMET
C27 = Wurth_Capacitors_WCAP-AS5H:WCAP-AS5H_5X5.5: WCAP-AS5H Aluminium Electrolytic Capacitors Long Life +105 °C Characteristics Long life product series Mounting style: V-Chip SMT Capacitance range: 0.1 µF ‒ 1000 µF Capacitance tolerance: ±20 % Voltage range (UR): 6.3 ‒ 50 V(DC) Operating temperature: -40 °C up to +105 °C Endurance: 5000 h @ +105 °C Dimensions (DxL) in mm: 4.0 x 5.5 up to 10.0 x 10.5 Recommended soldering: Reflow soldering Applications Long life applications (industry, medical) Input and output capacitor for switched-mode power supply Filtering Smoothing e.g. DC/DC converter, AC/DC converter, satellite receiver, control panel <https://www.we-online.com/catalog/media/o55801v209%20Family_WCAP-AS5H.jpg> Details see: https://www.we-online.com/catalog/en/WCAP-AS5H/ Updated by yingchun,Shan;2020-03-04 2020(C) Würth Elektronik; DATASHEET-URL: https://www.we-online.com/catalog/datasheet/865230542002.pdf; DF: 13%; DIAMETER: 5mm; I-LEAK: 3.5uA; I-RIPPLE: 25mA; L: 5.5mm; OPERATING-TEMPERATURE: -40 °C up to +105 °C; PART-NUMBER: 865230542002; TECHNICAL-REFERENCE: ASDC055100M035DVCTBE000; VR: 35V(DC); Z: 1.75288Ohm
C28 = C0805C224K5RACAUTO:C0805C224K5RACAUTO: Cap Ceramic 0.22uF 50V X7R 10% SMD 0805 125Â°C Punched Paper T/R; DESCRIPTION: 0.22µF ±10% 50V Ceramic Capacitor X7R 0805 _2012 Metric_; DIGI-KEY_PART_NUMBER: 399-6949-1-ND; DIGI-KEY_PURCHASE_URL: https://www.digikey.co.id/product-detail/en/kemet/C0805C224K5RACAUTO/399-6949-1-ND/3314457?utm_source=snapeda&utm_medium=aggregator&utm_campaign=symbol; MF: KEMET; MP: C0805C224K5RACAUTO; PACKAGE: 2012 KEMET
C29 C30 C63 C64 = LMK212BBJ226MD-T:LMK212BBJ226MD-T; DESCRIPTION: 22µF ±20% 10V Ceramic Capacitor X5R 0805 _2012 Metric_; DIGI-KEY_PART_NUMBER: 587-5917-1-ND; DIGI-KEY_PURCHASE_URL: https://www.digikey.co.id/product-detail/en/taiyo-yuden/LMK212BBJ226MD-T/587-5917-1-ND/7675037?utm_source=snapeda&utm_medium=aggregator&utm_campaign=symbol; MF: Taiyo Yuden; MP: LMK212BBJ226MD-T; PACKAGE: 2012 Taiyo Yuden
C48 = Wurth_Capacitors_WCAP-CSGP:WCAP-CSGP_0402: WCAP-CSGP MLCCs 0402 General Purpose Characteristics High performance ceramic High electrical precision and stability ceramic especially for NP0 Minimal aging especially for NP0 Mounting style: SMT-Chip Ceramic: NP0 (Class I), X5R (Class II), X7R (Class II) Capacitance range: 1 pF ‒ 10 µF Temperature Coefficient: ±30 ppm/°C; ±0.54 % for NP0 ±15 % for X5R and X7R Voltage range (UR): 6.3 ‒ 100 V(DC) Operating temperature: -55 °C up to + 125 °C for NP0 and X7R -55 °C up to + 85 °C for X5R Termination: Cu/Ni/Sn Recommended soldering: Reflow soldering Applications Temperature compensation (NP0) Coupling Decoupling Bypass Smoothing Filtering Resonant circuit <https://www.we-online.com/catalog/media/o157810v209%20Family_WE-MLCC_0805_weiss.jpg> Details see: https://www.we-online.com/catalog/en/WCAP-CSGP-0402/ Updated by yingchun,Shan;2020-03-06 2020(C) Würth Elektronik; CERAMIC-TYPE: X5R Class II; DATASHEET-URL: https://www.we-online.com/catalog/datasheet/885012105008.pdf; DF: 10%; H: 0.5mm; OPERATING-TEMPERATURE: -55 °C up to +85 °C; PART-NUMBER: 885012105008; QMIN: -; RISO: 0.02GOhm; TECHNICAL-REFERENCE: X5R0402475M6R3DFCT10000; TOL-VALUE: ±10%; VR: 6.3V(DC)
D1 = Wurth_EMC Components_WE-TVSP:WE-TVSP_DO-214AB_3000W_BI: WE-TVSP Power TVS Diode Characteristics Low Profile Package Glass passivated Juction Excellent clamping capability Fast response time MSL Level 1, per J-STD-020 Classification of the plastic case: UL 94 V-0 Safety certification UL 497B, E478010 Identical design: - DO-214AC = SMAJ - DO-214AA = SMBJ - DO-214AB = SMCJ/SMDJ Applications Ideal to protect the I/O Interfaces, Bus Voltage and other circuits of sensetive electronic equipment against voltage transiensts <https://katalog.we-online.com/media/images/v2/o55793v209%20WE-TVSP_600W-3000W_D0214AA_4C.jpg> Details see: https://katalog.we-online.com/en/pbs/WE-TVSP Updated by Ella Wu 2019-07-05 2019 (C) Würth Elektronik; DATASHEET-URL: https://katalog.we-online.com/pbs/datasheet/824551361.pdf; IPEAK: 51.6A; MOUNT: SMT; PART-NUMBER: 824551361; PDISS: 3000W; VBR: 42.1V; VCLAMP: 58.1V
D2 D5 = PMEG3050EP:PMEG3050EP
D3 = BZT52C12-13-F:BZT52C12-13-F; BUILT_BY: EMA_UL_Team; MANUFACTURER_PART_NUMBER: BZT52C12-13-F; SOURCELIBRARY: DiodesInc_2015-05-08; VENDOR: Diodes Inc
D4 = ESD234B1W0201E6327XTSA1:ESD234B1W0201E6327XTSA1: 12V (Typ) Clamp 7A (8/20µs) Ipp Tvs Diode Surface Mount WLL-2-1; DESCRIPTION: ESD/transient protection according to:; DIGI-KEY_PART_NUMBER: ESD234B1W0201E6327XTSA1CT-ND; DIGI-KEY_PURCHASE_URL: https://www.digikey.co.id/product-detail/en/infineon-technologies/ESD234B1W0201E6327XTSA1/ESD234B1W0201E6327XTSA1CT-ND/9974934?utm_source=snapeda&utm_medium=aggregator&utm_campaign=symbol; MF: Infineon Technologies; MP: ESD234B1W0201E6327XTSA1; PACKAGE: WLL-2-1 Infineon Technologies
FL1 = F6QA1G582H2JM-J:F6QA1G582H2JM-J: SAW Filter 50Ohm SMD 5-Pin T/R; DESCRIPTION: 1.582GHz Frequency GPS RF SAW Filter _Sound Acoustic Wave_ 1.8dB Bandwidth 5-SMD, No Lead; DIGI-KEY_PART_NUMBER: 587-3990-1-ND; DIGI-KEY_PURCHASE_URL: https://www.digikey.co.id/product-detail/en/taiyo-yuden/F6QA1G582H2JM-J/587-3990-1-ND/4963980?utm_source=snapeda&utm_medium=aggregator&utm_campaign=symbol; MF: Taiyo Yuden; MP: F6QA1G582H2JM-J; PACKAGE: SMD-5 Taiyo Yuden
J1 J2 = MMCX-P-P-X-ST-TH1:MMCX-P-P-X-ST-TH1
J3 J5 J11 = Wurth_Connectors_WR-WTB:61900211021: WR-WTB Male Left Angled Header Bottom Locking KIND PROPERTIES: Pitch:2.54 mm Gender:Male MATERIAL PROPERTIES: Insulator Material :Nylon 66 Insulator Flammability Rating:UL94 V-0 Insulator Color:Beige Contact Material:Copper Alloy Contact Plating:Tin Contact Type:Stamped GENERAL INFORMATION Operating Temperature:-40 up to +105 °C Compliance: RoHS Working Voltage:250 V (AC) Withstanding Voltage:1000 V (AC) Contact Resistance:20 mΩ RISO:1000 MΩ CERTIFICATION UL Approval:E323964 PACKAGING PROPERTIES Packaging:Bag <https://katalog.we-online.com/media/images/v2/o33344v209%20Family_WR-WTB_6190xx11021.jpg> Details see: https://katalog.we-online.com/en/em/WTB_2_54_MALE_LEFT_ANGLED_LOCKING_HEADER_6190XX11021 Updated by Yingchun,Shan 2019-11-05 2019 (C) Würth Elektronik; CONTACT-RESISTANCE: 20mOhm; DATASHEET-URL: https://www.we-online.com/catalog/datasheet/61900211021.pdf; GENDER: Male; L: 5.08mm; MOUNT: THT; PACKAGING: Bag; PART-NUMBER: 61900211021; PCB-CABLE-PANEL: PCB; PINS: 2; PITCH: 2.54mm; TOL-R: max.; TYPE: Right Angled Bottom Locking; USE-WITH: WR-WTB 2.54 mm Female Terminal Housing; WORKING-VOLTAGE: 250V(AC)
J4 J6 J7 = Wurth_Connectors_WR-WTB:61900311021: WR-WTB Male Left Angled Header Bottom Locking KIND PROPERTIES: Pitch:2.54 mm Gender:Male MATERIAL PROPERTIES: Insulator Material :Nylon 66 Insulator Flammability Rating:UL94 V-0 Insulator Color:Beige Contact Material:Copper Alloy Contact Plating:Tin Contact Type:Stamped GENERAL INFORMATION Operating Temperature:-40 up to +105 °C Compliance: RoHS Working Voltage:250 V (AC) Withstanding Voltage:1000 V (AC) Contact Resistance:20 mΩ RISO:1000 MΩ CERTIFICATION UL Approval:E323964 PACKAGING PROPERTIES Packaging:Bag <https://katalog.we-online.com/media/images/v2/o33344v209%20Family_WR-WTB_6190xx11021.jpg> Details see: https://katalog.we-online.com/en/em/WTB_2_54_MALE_LEFT_ANGLED_LOCKING_HEADER_6190XX11021 Updated by Yingchun,Shan 2019-11-05 2019 (C) Würth Elektronik; CONTACT-RESISTANCE: 20mOhm; DATASHEET-URL: https://www.we-online.com/catalog/datasheet/61900311021.pdf; GENDER: Male; L: 7.62mm; MOUNT: THT; PACKAGING: Bag; PART-NUMBER: 61900311021; PCB-CABLE-PANEL: PCB; PINS: 3; PITCH: 2.54mm; TOL-R: max.; TYPE: Right Angled Bottom Locking; USE-WITH: WR-WTB 2.54 mm Female Terminal Housing; WORKING-VOLTAGE: 250V(AC)
J8 = Headers:61300511121: CONN HEADER VERT 5POS 2.54MM Manufacturer's datasheet <https://katalog.we-online.de/em/datasheet/6130xx11121.pdf>; CREATED_BY: PCBLayout.com; DIGI_KEY_PART_NUMBER: 732-5318-ND; MANUFACTURER: Wurth Electronics Inc.; MPN: 61300511121
J9 = Wurth_Connectors_WR-WTB:61900411121: WR-WTB 2.54 mm Male Locking Header KIND PROPERTIES: Pitch:2.54 mm Gender:Male MATERIAL PROPERTIES: Insulator Material :PA66 Insulator Flammability Rating:UL94 V-0 Insulator Color:Beige Contact Material:Copper Alloy Contact Plating:Tin Contact Type:Stamped GENERAL INFORMATION Operating Temperature:-40 up to +105 °C Compliance: RoHS Working Voltage:250 V (AC) Withstanding Voltage:1000 V (AC) Contact Resistance:20 mΩ RISO:1000 MΩ CERTIFICATION UL Approval:E323964 PACKAGING PROPERTIES Packaging:Bag <https://katalog.we-online.com/media/images/v2/o33345v209%20Family_WR-WTB_6190xx11121.jpg> Details see: https://katalog.we-online.com/en/em/WTB_2_54_MALE_LOCKING_HEADER_6190XX11121 Updated by Yingchun,Shan 2019-11-05 2019 (C) Würth Elektronik; CONTACT-RESISTANCE: 20mOhm; DATASHEET-URL: https://www.we-online.com/catalog/datasheet/61900411121.pdf; GENDER: Male; L: 10.16mm; MOUNT: THT; PACKAGING: Bag; PART-NUMBER: 61900411121; PCB-CABLE-PANEL: PCB; PINS: 4; PITCH: 2.54mm; TOL-R: max.; TYPE: Vertical; USE-WITH: WR-WTB 2.54 mm Female Terminal Housing; WORKING-VOLTAGE: 250V(AC)
J10 = Wurth_Connectors_WR-CRD:693071020811: WR-CRD Micro SD Card Connector Push & Push 8 pins KIND PROPERTIES Quality Class 10 000 Mating cycles Gender Socket Type Push & Push MATERIAL PROPERTIES Insulator Material LCP Insulator Flammability Rating UL94 V-0 Insulator Color Black Color Black Cover Material Stainless Steel Contact Material Copper Alloy Contact Plating Selective Gold;​ 1 u' on contact area Contact Type Stamped GENERAL INFORMATION Operating Temperature -25 up to +85 °C;​ -40 up to +85 °C Compliance RoHS ELECTRICAL PROPERTIES Working Voltage 100 V (AC);​ 30 V (AC) Withstanding Voltage 500 V (AC) Contact Resistance 100 mΩ Contact Resistance 500 mΩ Details see: https://katalog.we-online.com/en/em/CRD_SD_MICRO_PUSH_AND_PULL_8_PINS Created by Ella Wu 2019-11-05 2019(C) Wurth Elektronik; DATASHEET-URL: https://www.we-online.com/catalog/datasheet/693071020811.pdf; GERDER: Socket; MOUNT: SMT; PART-NUMBER: 693071020811; PINS: 8; TYPE: Push & Push
J12 = SAMTEC-CLP-110-02-X-D:SAMTEC-CLP-110-02-X-D
J13 = Wurth_Connectors_WR-WTB:61900211121: WR-WTB 2.54 mm Male Locking Header KIND PROPERTIES: Pitch:2.54 mm Gender:Male MATERIAL PROPERTIES: Insulator Material :PA66 Insulator Flammability Rating:UL94 V-0 Insulator Color:Beige Contact Material:Copper Alloy Contact Plating:Tin Contact Type:Stamped GENERAL INFORMATION Operating Temperature:-40 up to +105 °C Compliance: RoHS Working Voltage:250 V (AC) Withstanding Voltage:1000 V (AC) Contact Resistance:20 mΩ RISO:1000 MΩ CERTIFICATION UL Approval:E323964 PACKAGING PROPERTIES Packaging:Bag <https://katalog.we-online.com/media/images/v2/o33345v209%20Family_WR-WTB_6190xx11121.jpg> Details see: https://katalog.we-online.com/en/em/WTB_2_54_MALE_LOCKING_HEADER_6190XX11121 Updated by Yingchun,Shan 2019-11-05 2019 (C) Würth Elektronik; CONTACT-RESISTANCE: 20mOhm; DATASHEET-URL: https://www.we-online.com/catalog/datasheet/61900211121.pdf; GENDER: Male; L: 5.08mm; MOUNT: THT; PACKAGING: Bag; PART-NUMBER: 61900211121; PCB-CABLE-PANEL: PCB; PINS: 2; PITCH: 2.54mm; TOL-R: max.; TYPE: Vertical; USE-WITH: WR-WTB 2.54 mm Female Terminal Housing; WORKING-VOLTAGE: 250V(AC)
J14 = Wurth_Connectors_WR-WTB:61900311121: WR-WTB 2.54 mm Male Locking Header KIND PROPERTIES: Pitch:2.54 mm Gender:Male MATERIAL PROPERTIES: Insulator Material :PA66 Insulator Flammability Rating:UL94 V-0 Insulator Color:Beige Contact Material:Copper Alloy Contact Plating:Tin Contact Type:Stamped GENERAL INFORMATION Operating Temperature:-40 up to +105 °C Compliance: RoHS Working Voltage:250 V (AC) Withstanding Voltage:1000 V (AC) Contact Resistance:20 mΩ RISO:1000 MΩ CERTIFICATION UL Approval:E323964 PACKAGING PROPERTIES Packaging:Bag <https://katalog.we-online.com/media/images/v2/o33345v209%20Family_WR-WTB_6190xx11121.jpg> Details see: https://katalog.we-online.com/en/em/WTB_2_54_MALE_LOCKING_HEADER_6190XX11121 Updated by Yingchun,Shan 2019-11-05 2019 (C) Würth Elektronik; CONTACT-RESISTANCE: 20mOhm; DATASHEET-URL: https://www.we-online.com/catalog/datasheet/61900311121.pdf; GENDER: Male; L: 7.62mm; MOUNT: THT; PACKAGING: Bag; PART-NUMBER: 61900311121; PCB-CABLE-PANEL: PCB; PINS: 3; PITCH: 2.54mm; TOL-R: max.; TYPE: Vertical; USE-WITH: WR-WTB 2.54 mm Female Terminal Housing; WORKING-VOLTAGE: 250V(AC)
J15 = Headers:61300311121: CONN HEADER VERT 3POS 2.54MM Manufacturer's datasheet <https://katalog.we-online.de/em/datasheet/6130xx11121.pdf>; CREATED_BY: PCBLayout.com; DIGI_KEY_PART_NUMBER: 732-5316-ND; MANUFACTURER: Wurth Electronics Inc.; MPN: 61300311121
L1 L2 = Wurth_Automotive_WE-MAIA:WE-MAIA_4020: WE-MAIA SMD Power Inductor Characteristics Magnetic iron alloy allows high rated currents Compact design Magnetically shielded Hight current capability and handles hight transient current spikes No acoustic noise and no leakage flux noise Operating temperature range: -40°C up to +125°C Applications Power supplies for mobile devices DC/DC-converter for high current power supplies DC/DC-converter for Field Programmable Gate Array (FPGA) POL-converters Microcontroller Portable as well as battery-driven devices Wireless communication devices <https://katalog.we-online.de/media/images/v2/o56285v209%20Family_WE-MAIA.jpg> Details see: https://katalog.we-online.de/en/am/WE-MAIA Updated By Ella Wu 2019-09-10 2019 (C) Wurth Elektronik; DATASHEET-URL: https://katalog.we-online.de/am/datasheet/78438356022.pdf; FRES: 34MHz; IR: 4.7A; ISAT: 6.2A; MOUNT: SMT; PART-NUMBER: 78438356022; RDC: 35mOhm
L3 = Wurth_EMC Components_WE-CBF:WE-CBF_0603: WE-CBF SMD EMI Suppression Ferrite Bead Characteristics Reliable Ni-Sn electrodes High rated current up to 6 A Operating temperature: –55 ºC to +125 ºC Applications Perfect as data lined filter and for uncoupling of distribution voltage Package name and Variant abbreviation: Package: Wide Band /High Speed: W=Width= 2.2 High Current: W=Width= 2.6 Variant abbreviation: WB = Wide Band HS=High Speed HC=High Current <https://katalog.we-online.de/media/images/v2/o14753v209%20Family_WE-CBF.jpg> Details see: http://katalog.we-online.de/en/pbs/WE-CBF Updated by Ella Wu 2019-01-02 2019 (C) Wurth Elektronik; DATASHEET-URL: https://www.we-online.com/catalog/datasheet/742792651.pdf; IR1: 1000mA; IR2: -; MOUNT: SMT; PART-NUMBER: 742792651; RDC-MAX: 0.2Ohm; TYPE: High Current; Z: 258Ohm@1GMHz; ZMAX: 800Ohm
L4 = LQG15HS27NJ02D:LQG15HS27NJ02D: Inductor RF Chip Unshielded Multi-Layer 27nH 5% 100MHz 8Q-Factor Ceramic 300mA 460mOhm DCR 0402 T/R; DESCRIPTION: Inductor with Inductance: 27nH Tol. +/-5%, Package: 0402 _1005_; DIGI-KEY_PART_NUMBER: 490-2628-1-ND; DIGI-KEY_PURCHASE_URL: https://www.digikey.co.id/product-detail/en/murata-electronics/LQG15HS27NJ02D/490-2628-1-ND/662908?utm_source=snapeda&utm_medium=aggregator&utm_campaign=symbol; MF: Murata; MP: LQG15HS27NJ02D; PACKAGE: 1005 Murata
L5 = LQW15AN5N6C10D:LQW15AN5N6C10D: Ind RF Chip Wirewound 5.6nH 0.2nH 100MHz 30Q-Factor 800mA 0402 Paper T/R; DESCRIPTION: Inductor with Inductance: 5.6nH Tol. +/-0.2nH, Package: 0402 _1005_; DIGI-KEY_PART_NUMBER: 490-6833-1-ND; DIGI-KEY_PURCHASE_URL: https://www.digikey.co.id/product-detail/en/murata-electronics/LQW15AN5N6C10D/490-6833-1-ND/3846030?utm_source=snapeda&utm_medium=aggregator&utm_campaign=symbol; MF: Murata; MP: LQW15AN5N6C10D; PACKAGE: 1006 Murata
R1-R3 R5 R9-R16 R18-R21 = Resistor Capacitor Standard Eagle 3D:R0402-VISHAYDALE
R4 R6-R8 = Resistor Capacitor Standard Eagle 3D:R0402-TE
R17 = TNPW0603100KBETA:TNPW0603100KBETA: RES, THIN FILM, 100K, 0.1%, 0.1W, 0603,; DESCRIPTION: Res Thin Film 0603 100K Ohm 0.1% 1/10W ±25ppm/°C Molded SMD SMD Paper T/R; DIGI-KEY_PART_NUMBER: 541-3570-1-ND; DIGI-KEY_PURCHASE_URL: https://www.digikey.com/product-detail/en/vishay-dale/TNPW0603100KBETA/541-3570-1-ND/7354930?utm_source=snapeda&utm_medium=aggregator&utm_campaign=symbol; MF: Vishay Dale; MP: TNPW0603100KBETA; PACKAGE: 1608 Vishay
RS1 = HCSM2818FT20L0:HCSM2818FT20L0_2
SUPPLY4-SUPPLY7 = SparkFun-PowerSymbols:2PT_GND_TIE: Dual Ground Supply Power supply symbol for connecting two grounds. SparkFun Products: SparkFun AutoDriver - Stepper Motor Driver <https://www.sparkfun.com/products/11611>
SW1 = TL3342F160QG:TL3342F160QG: TL3342 Series SPST 1.6 N Round Button Gull Wing Surface Mount Tactile Switch; AVAILABILITY: Unavailable; DESCRIPTION: Tactile Switch SPST-NO Top Actuated Surface Mount; MF: E-Switch; MP: TL3342F160QG; PACKAGE: None; PRICE: None
T1 = SUM110P06-07L-E3:SUM110P06-07L-E3
U1 = STM32F413VHT6:STM32F413VHT6
U2 = LM3671MF-3.3:LM3671MF-3.3: IC BUCK SYNC 3.3V 0.6A; AVAILABILITY: Unavailable; DESCRIPTION: Buck Switching Regulator IC Positive Fixed 3.3V 1 Output 600mA SC-74A, SOT-753; MF: Texas Instruments; MP: LM3671MF-3.3/NOPB; PACKAGE: SOT-23 Texas Instruments; PRICE: None
U3 = LMR33630:LMR33630ADDAR
U4 = REF2933AIDBZR:REF2933AIDBZR
U5 = BT832X:BT832X
U6 U7 = MAX232E:MAX232E
U8 = FT234XD-R:FT234XD-R: USB Full Speed to Basic UART IC with USB Charger Detection
U9 = TEWSBPPTLibrary:MAX5490
U10 = teseo-liv3f:TESEO-LIV3F; BUILT_BY: EMA_Jessica; COPYRIGHT: Copyright (C) 2018 Accelerated Designs. All rights reserved; MANUFACTURER_PART_NUMBER: TESEO-LIV3F; VENDOR: STMicroelectronics
U11 = INF-TSLP-6-2_V:BGA725L6E6327FTSA1
U12 = DS3231S:DS3231S; AVAILABILITY: Unavailable; DESCRIPTION: Real Time Clock _RTC_ IC Clock/Calendar I²C, 2-Wire Serial 16-SOIC _0.295, 7.50mm Width_; MF: Maxim Integrated; MP: DS3231S; PACKAGE: SOIC-16 Maxim Integrated; PRICE: None
U13 = CostumHafiz:24LC01B
U14 = LTC4151IMS:LTC4151IMS
U15 = TEWSBPPTLibrary:MMBT2907ALT1G
U16 = TEWSBPPTLibrary:IIS328DQ
Y1 = ECS-250-20-33-CKM-TR:ECS-250-20-33-CKM-TR: The sub miniature ECX-32 is a compact SMD Crystal. The 3.2 x 2.5 x 0.8 mm ceramic package is ideal for today’s SMD manufacturing environment.; DESCRIPTION: 25MHz ±10ppm Crystal 20pF 40 Ohms 4-SMD, No Lead; DIGI-KEY_PART_NUMBER: XC1817CT-ND; DIGI-KEY_PURCHASE_URL: https://www.digikey.co.id/product-detail/en/ecs-inc/ECS-250-20-33-CKM-TR/XC1817CT-ND/2781942?utm_source=snapeda&utm_medium=aggregator&utm_campaign=symbol; MF: ECS Inc.; MP: ECS-250-20-33-CKM-TR; PACKAGE: SMD-4 ECS International
Y2 = ECS-.327-12.5-34B-TR:ECS-.327-12.5-34B-TR: Crystal 2-SMD, No Lead; DESCRIPTION: 32.768kHz ±20ppm Crystal 12.5pF 70 kOhms 2-SMD, No Lead; DIGI-KEY_PART_NUMBER: XC1617CT-ND; DIGI-KEY_PURCHASE_URL: https://www.digikey.co.id/product-detail/en/ecs-inc/ECS-.327-12.5-34B-TR/XC1617CT-ND/1693786?utm_source=snapeda&utm_medium=aggregator&utm_campaign=symbol; MF: ECS Inc.; MP: ECS-.327-12.5-34B-TR; PACKAGE: SMD-2 ECS International
Y3-Y5 = U.FL-R-SMT-1_10_:U.FL